# EAGLE design GFB_Sensorknoten (EAGLE 9.6.2)

## Sheet 1 of 6: Spannungsversorgung
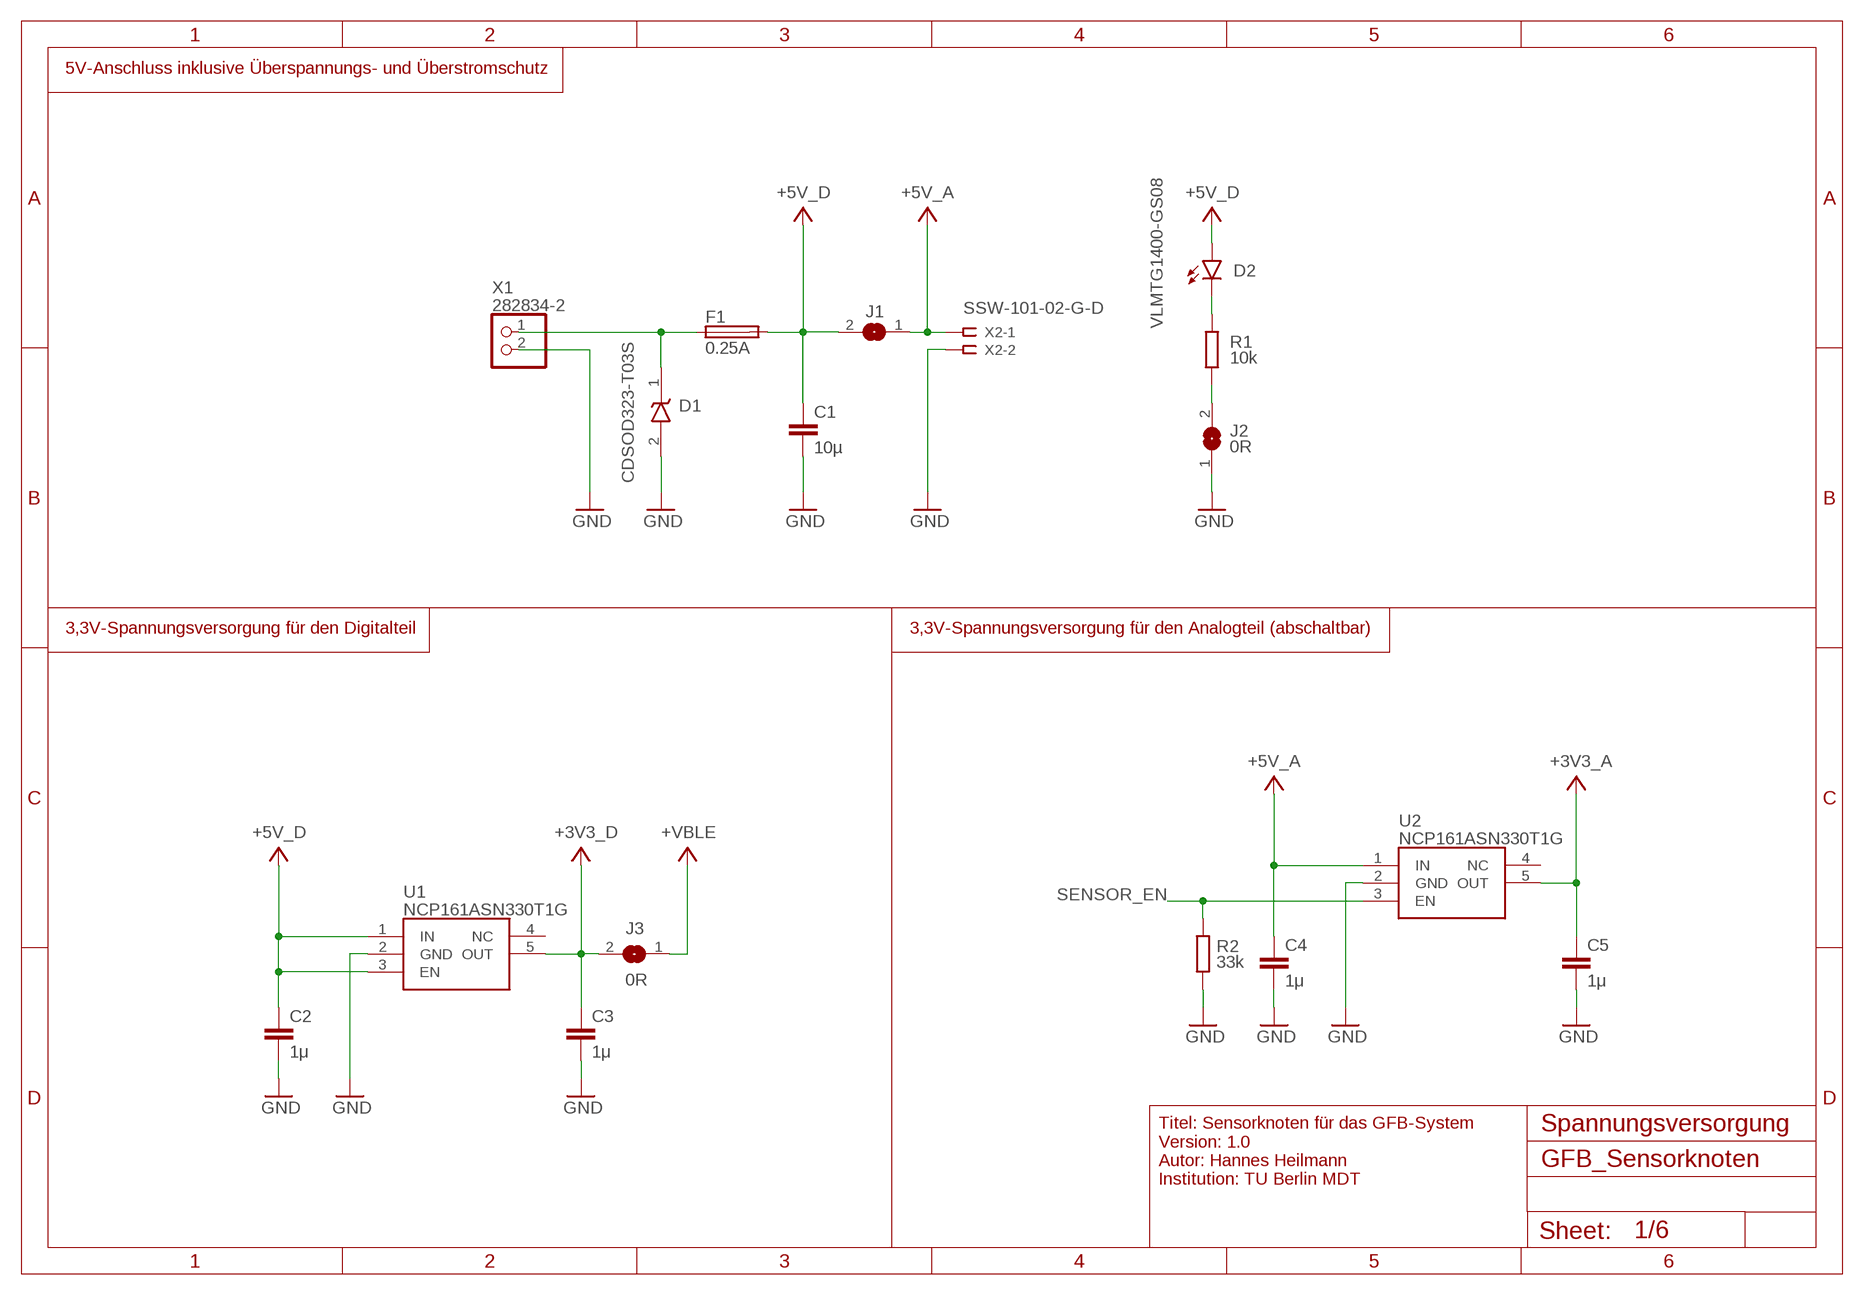
[diagram p0: schematic, sheet 1]

### Parts
C1  10µ  C_OUTLINEC0603_OUTLINE  [PATCHPOLYGRAPHV1_1608M]
C2  1μ  C_OUTLINEC0603_OUTLINE  [PATCHPOLYGRAPHV1_1608M]
C3  1μ  C_OUTLINEC0603_OUTLINE  [PATCHPOLYGRAPHV1_1608M]
C4  1μ  C_OUTLINEC0603_OUTLINE  [PATCHPOLYGRAPHV1_1608M]
C5  1μ  C_OUTLINEC0603_OUTLINE  [PATCHPOLYGRAPHV1_1608M]
D1  CDSOD323-T03S  [SOD2513X114N]
D2  VLMTG1400-GS08  LEDCHIP-LED0603  [CHIP-LED0603]
F1  SF-0603FP025F-2  [R0603]
J1  SJ  [SJ]
J2  0R  JUMPER_0402  [PATCHPOLYGRAPHV1_1005M]
J3  0R  JUMPER_0402  [PATCHPOLYGRAPHV1_1005M]
R1  10k  R_OUTLINER0402_OUTLINE  [PATCHPOLYGRAPHV1_1005M]
R2  33k  R_OUTLINER0402_OUTLINE  [PATCHPOLYGRAPHV1_1005M]
U1  NCP161ASN330T1G  [SOT95P280X145-5N]
U2  NCP161ASN330T1G  [SOT95P280X145-5N]
X1  282834-2  [SHDR2W85P0X254_1X2_554X650X103]
X2  SSW-101-02-G-D  [SSW-101-02-G-D]

### Nets
+3V3_A: C5.1 U2.5(OUT) ; also sheet 3,4
+3V3_D: C3.1 J3.2 U1.5(OUT) ; also sheet 3,5,6
+5V_A: C4.1 J1.1 U2.1(IN) X2.1
+5V_D: C1.1 C2.1 D2.A F1.2 J1.2 U1.1(IN) U1.3(EN)
+VBLE: J3.1 ; also sheet 2
GND: C1.2 C2.2 C3.2 C4.2 C5.2 D1.2(A) J2.1 R2.1 U1.2(GND) U2.2(GND) X1.2 X2.2 ; also sheet 2,3,4,5,6
N$1: J2.2 R1.1
N$24: D2.C R1.2
N$26: D1.1(K) F1.1 X1.1
SENSOR_EN: R2.2 U2.3(EN) ; also sheet 3
Unconnected: U1.4(NC) U2.4(NC)

### Notes on the sheet
- 5V-Anschluss inklusive Überspannungs- und Überstromschutz
- 0.25A
- 3,3V-Spannungsversorgung für den Digitalteil | 3,3V-Spannungsversorgung für den Analogteil (abschaltbar)
- Spannungsversorgung
- Titel: Sensorknoten für das GFB-System
  Version: 1.0
  Autor: Hannes Heilmann
  Institution: TU Berlin MDT

## Sheet 2 of 6: Data-Transmission-MCU
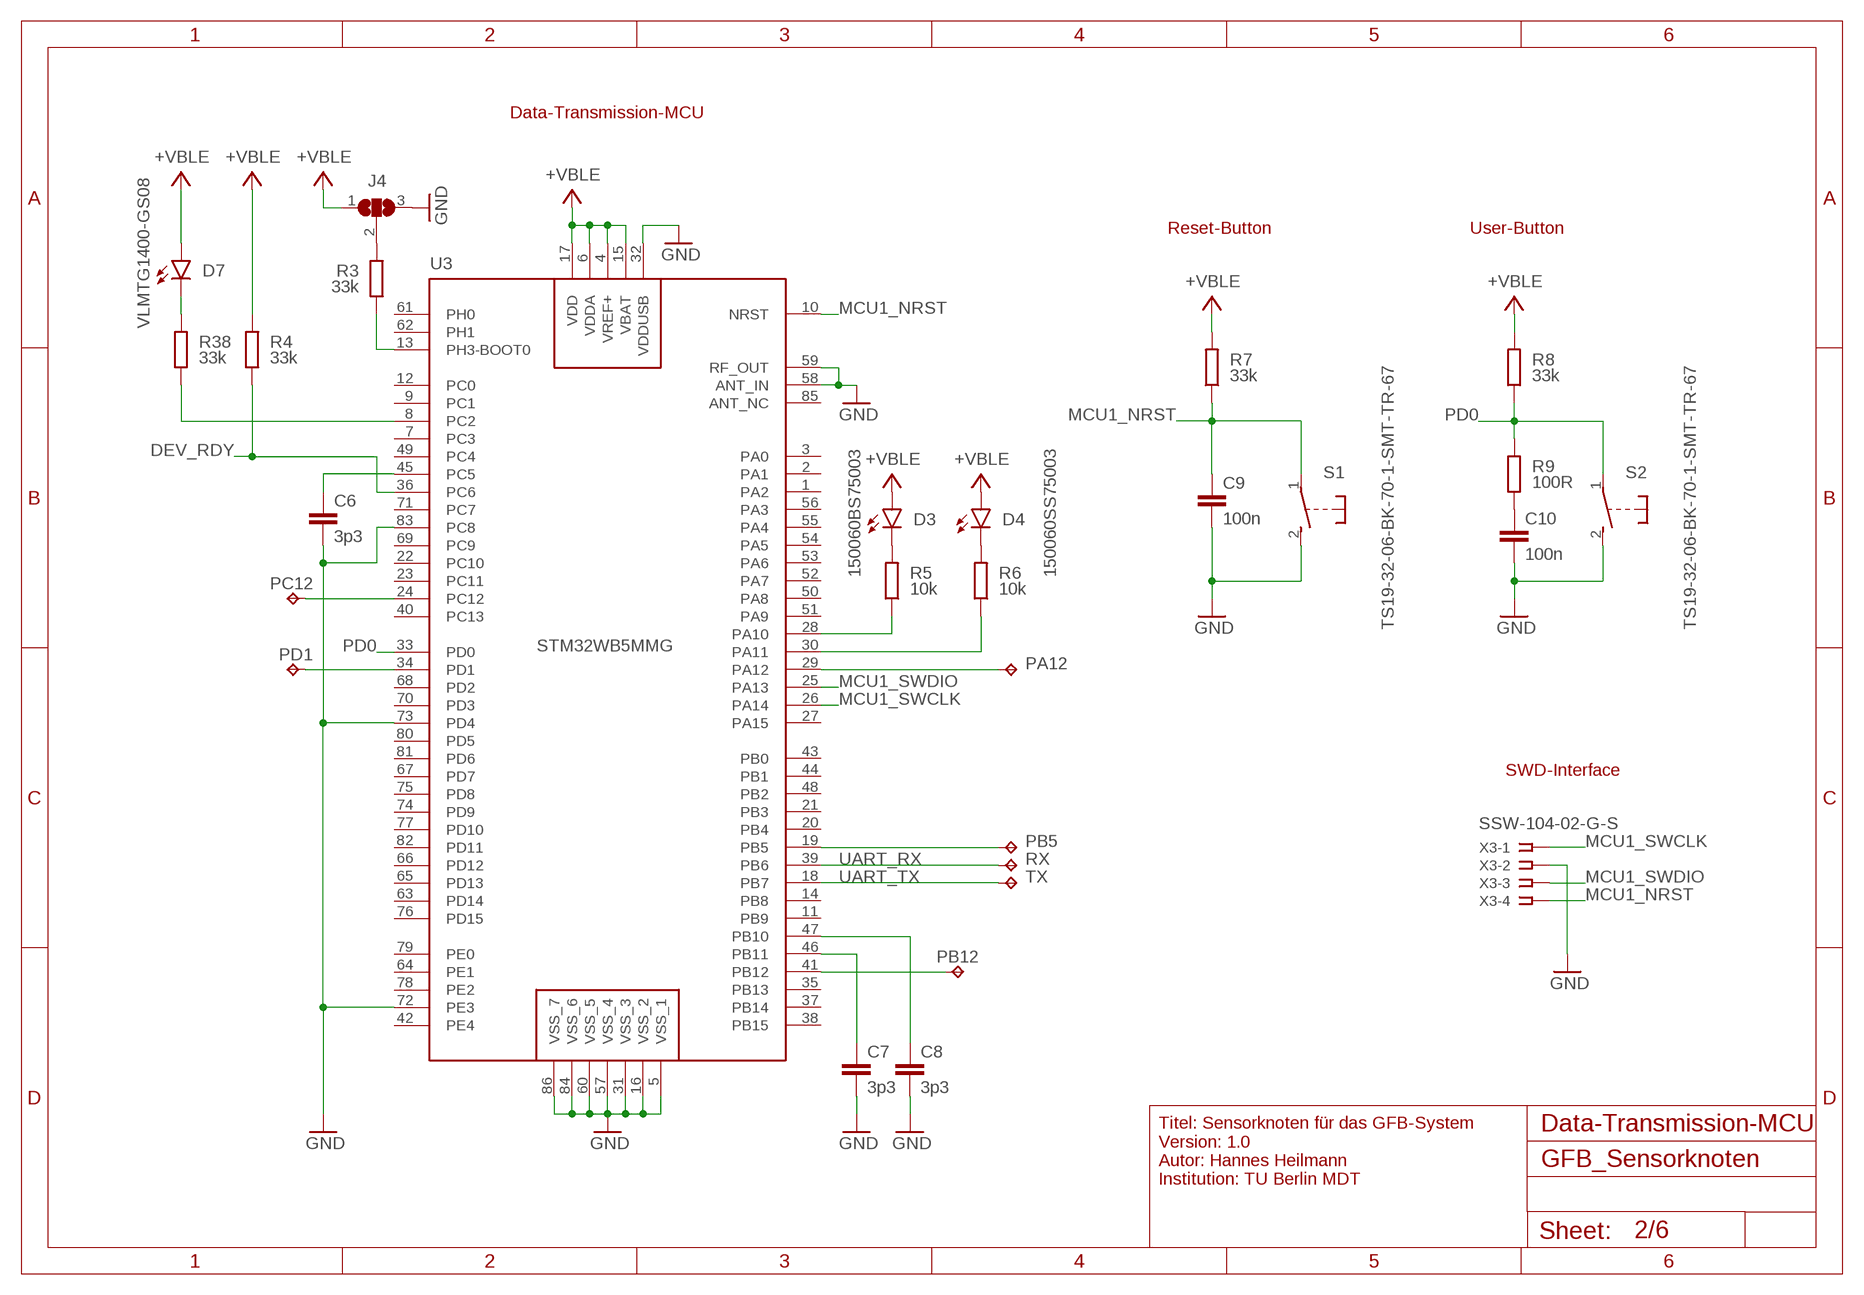
[diagram p1: schematic, sheet 2]

### Parts
C6  3p3  C_OUTLINEC0402_OUTLINE  [PATCHPOLYGRAPHV1_1005M]
C7  3p3  C_OUTLINEC0402_OUTLINE  [PATCHPOLYGRAPHV1_1005M]
C8  3p3  C_OUTLINEC0402_OUTLINE  [PATCHPOLYGRAPHV1_1005M]
C9  100n  C_OUTLINEC0402_OUTLINE  [PATCHPOLYGRAPHV1_1005M]
C10  100n  C_OUTLINEC0402_OUTLINE  [PATCHPOLYGRAPHV1_1005M]
D3  150060BS75003  LEDCHIP-LED0603  [CHIP-LED0603]
D4  150060SS75003  LEDCHIP-LED0603  [CHIP-LED0603]
D7  VLMTG1400-GS08  LEDCHIP-LED0603  [CHIP-LED0603]
J4  JUMPER_3JUMPER_3_0402  [JUMPER_3_0402]
PA12  TPTP06R  [TP06R]
PB5  TPTP06R  [TP06R]
PB12  TPTP06R  [TP06R]
PC12  TPTP06R  [TP06R]
PD1  TPTP06R  [TP06R]
R3  33k  R_OUTLINER0402_OUTLINE  [PATCHPOLYGRAPHV1_1005M]
R4  33k  R_OUTLINER0402_OUTLINE  [PATCHPOLYGRAPHV1_1005M]
R5  10k  R_OUTLINER0402_OUTLINE  [PATCHPOLYGRAPHV1_1005M]
R6  10k  R_OUTLINER0402_OUTLINE  [PATCHPOLYGRAPHV1_1005M]
R7  33k  R_OUTLINER0402_OUTLINE  [PATCHPOLYGRAPHV1_1005M]
R8  33k  R_OUTLINER0402_OUTLINE  [PATCHPOLYGRAPHV1_1005M]
R9  100R  R_OUTLINER0402_OUTLINE  [PATCHPOLYGRAPHV1_1005M]
R38  33k  R_OUTLINER0402_OUTLINE  [PATCHPOLYGRAPHV1_1005M]
RX  TPTP06R  [TP06R]
S1  TS19-32-06-BK-70-1-SMT-TR-67  [TS193206BK701SMTTR67]
S2  TS19-32-06-BK-70-1-SMT-TR-67  [TS193206BK701SMTTR67]
TX  TPTP06R  [TP06R]
U3  STM32WB5MMG  [STM32WB5MMG]
X3  SSW-104-02-G-S  [SSW-104-02-G-S]

### Nets
+VBLE: D3.A D4.A D7.A J4.1 R4.2 R7.2 R8.2 U3.4(VREF+) U3.6(VDDA) U3.15(VBAT) U3.17(VDD) ; also sheet 1
DEV_RDY: R4.1 U3.36(PC6) ; also sheet 3
GND: C6.2 C7.2 C8.2 C9.2 C10.2 J4.3 S1.2(S) S2.2(S) U3.5(VSS_1) U3.16(VSS_2) U3.31(VSS_3) U3.32(VDDUSB) U3.57(VSS_4) U3.58(ANT_IN) U3.59(RF_OUT) U3.60(VSS_5) U3.72(PE3) U3.73(PD4) U3.83(PC8) U3.84(VSS_6) U3.86(VSS_7) X3.2 ; also sheet 1,3,4,5,6
MCU1_NRST: C9.1 R7.1 S1.1(P) U3.10(NRST) X3.4
MCU1_SWCLK: U3.26(PA14) X3.1
MCU1_SWDIO: U3.25(PA13) X3.3
N$6: R3.1 U3.13(PH3-BOOT0)
N$10: C6.1 U3.45(PC5)
N$11: D3.C R5.2
N$17: D4.C R6.2
N$19: C10.1 R9.1
N$20: PB12.TP U3.41(PB12)
N$21: PD1.TP U3.34(PD1)
N$22: PC12.TP U3.24(PC12)
N$27: R38.1 U3.8(PC2)
N$30: D7.C R38.2
N$38: J4.2 R3.2
PA10: R5.1 U3.28(PA10)
PA11: R6.1 U3.30(PA11)
PB10: C8.1 U3.47(PB10)
PB11: C7.1 U3.46(PB11)
PD0: R8.1 R9.2 S2.1(P) U3.33(PD0)
UART_RES_RX: PA12.TP U3.29(PA12)
UART_RES_TX: PB5.TP U3.19(PB5)
UART_RX: RX.TP U3.39(PB6) ; also sheet 3
UART_TX: TX.TP U3.18(PB7) ; also sheet 3
Unconnected: U3.1(PA2) U3.2(PA1) U3.3(PA0) U3.7(PC3) U3.9(PC1) U3.11(PB9) U3.12(PC0) U3.14(PB8) U3.20(PB4) U3.21(PB3) U3.22(PC10) U3.23(PC11) U3.27(PA15) U3.35(PB13) U3.37(PB14) U3.38(PB15) U3.40(PC13) U3.42(PE4) U3.43(PB0) U3.44(PB1) U3.48(PB2) U3.49(PC4) U3.50(PA8) U3.51(PA9) U3.52(PA7) U3.53(PA6) U3.54(PA5) U3.55(PA4) U3.56(PA3) U3.61(PH0) U3.62(PH1) U3.63(PD14) U3.64(PE1) U3.65(PD13) U3.66(PD12) U3.67(PD7) U3.68(PD2) U3.69(PC9) U3.70(PD3) U3.71(PC7) U3.74(PD9) U3.75(PD8) U3.76(PD15) U3.77(PD10) U3.78(PE2) U3.79(PE0) U3.80(PD5) U3.81(PD6) U3.82(PD11) U3.85(ANT_NC)

### Notes on the sheet
- Data-Transmission-MCU
- Reset-Button | User-Button
- SWD-Interface
- Data-Transmission-MCU
- Titel: Sensorknoten für das GFB-System
  Version: 1.0
  Autor: Hannes Heilmann
  Institution: TU Berlin MDT

## Sheet 3 of 6: Data-Aquisition-MCU
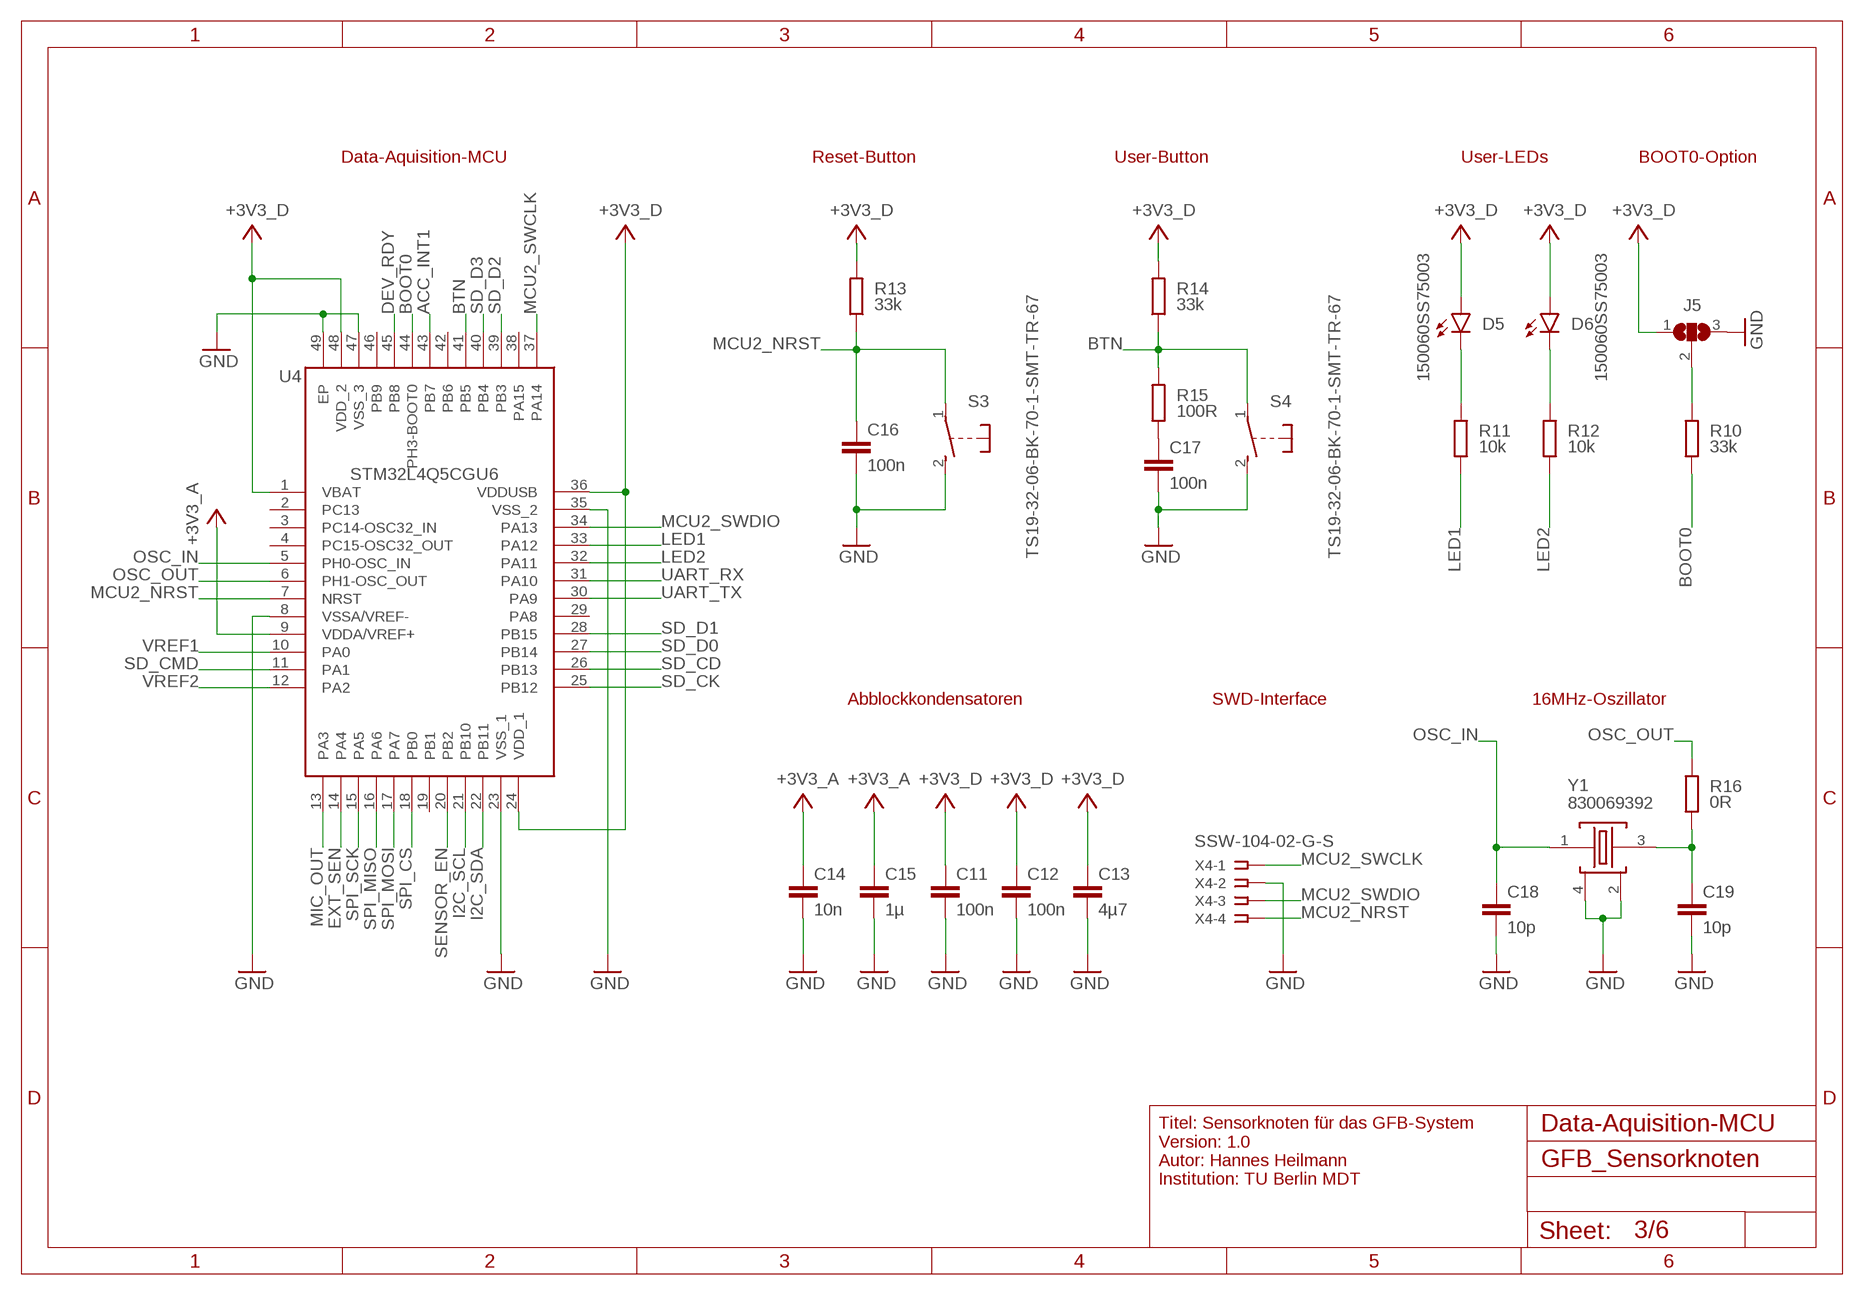
[diagram p2: schematic, sheet 3]

### Parts
C11  100n  C_OUTLINEC0402_OUTLINE  [PATCHPOLYGRAPHV1_1005M]
C12  100n  C_OUTLINEC0402_OUTLINE  [PATCHPOLYGRAPHV1_1005M]
C13  4µ7  C_OUTLINEC0603_OUTLINE  [PATCHPOLYGRAPHV1_1608M]
C14  10n  C_OUTLINEC0402_OUTLINE  [PATCHPOLYGRAPHV1_1005M]
C15  1µ  C_OUTLINEC0603_OUTLINE  [PATCHPOLYGRAPHV1_1608M]
C16  100n  C_OUTLINEC0402_OUTLINE  [PATCHPOLYGRAPHV1_1005M]
C17  100n  C_OUTLINEC0402_OUTLINE  [PATCHPOLYGRAPHV1_1005M]
C18  10p  C_OUTLINEC0402_OUTLINE  [PATCHPOLYGRAPHV1_1005M]
C19  10p  C_OUTLINEC0402_OUTLINE  [PATCHPOLYGRAPHV1_1005M]
D5  150060SS75003  LEDCHIP-LED0603  [CHIP-LED0603]
D6  150060SS75003  LEDCHIP-LED0603  [CHIP-LED0603]
J5  JUMPER_3JUMPER_3_0402  [JUMPER_3_0402]
R10  33k  R_OUTLINER0402_OUTLINE  [PATCHPOLYGRAPHV1_1005M]
R11  10k  R_OUTLINER0402_OUTLINE  [PATCHPOLYGRAPHV1_1005M]
R12  10k  R_OUTLINER0402_OUTLINE  [PATCHPOLYGRAPHV1_1005M]
R13  33k  R_OUTLINER0402_OUTLINE  [PATCHPOLYGRAPHV1_1005M]
R14  33k  R_OUTLINER0402_OUTLINE  [PATCHPOLYGRAPHV1_1005M]
R15  100R  R_OUTLINER0402_OUTLINE  [PATCHPOLYGRAPHV1_1005M]
R16  0R  R_OUTLINER0402_OUTLINE  [PATCHPOLYGRAPHV1_1005M]
S3  TS19-32-06-BK-70-1-SMT-TR-67  [TS193206BK701SMTTR67]
S4  TS19-32-06-BK-70-1-SMT-TR-67  [TS193206BK701SMTTR67]
U4  STM32L4Q5CGU6  [QFN50P700X700X65-49N]
X4  SSW-104-02-G-S  [SSW-104-02-G-S]
Y1  830069392  [830069392]

### Nets
+3V3_A: C14.1 C15.1 U4.9(VDDA/VREF+) ; also sheet 1,4
+3V3_D: C11.1 C12.1 C13.1 D5.A D6.A J5.1 R13.2 R14.2 U4.1(VBAT) U4.24(VDD_1) U4.36(VDDUSB) U4.48(VDD_2) ; also sheet 1,5,6
ACC_INT1: U4.43(PB7) ; also sheet 5
BOOT0: R10.1 U4.44(PH3-BOOT0)
BTN: R14.1 R15.2 S4.1(P) U4.41(PB5)
DEV_RDY: U4.45(PB8) ; also sheet 2
EXT_SEN: U4.14(PA4) ; also sheet 4
GND: C11.2 C12.2 C13.2 C14.2 C15.2 C16.2 C17.2 C18.2 C19.2 J5.3 S3.2(S) S4.2(S) U4.8(VSSA/VREF-) U4.23(VSS_1) U4.35(VSS_2) U4.47(VSS_3) U4.49(EP) X4.2 Y1.2(GND_1) Y1.4(GND_2) ; also sheet 1,2,4,5,6
I2C_SCL: U4.21(PB10) ; also sheet 5
I2C_SDA: U4.22(PB11) ; also sheet 5
LED1: R11.1 U4.33(PA12)
LED2: R12.1 U4.32(PA11)
MCU2_NRST: C16.1 R13.1 S3.1(P) U4.7(NRST) X4.4
MCU2_SWCLK: U4.37(PA14) X4.1
MCU2_SWDIO: U4.34(PA13) X4.3
MIC_OUT: U4.13(PA3) ; also sheet 4
N$2: C17.1 R15.1
N$23: C19.1 R16.1 Y1.3(OSC_2)
N$28: D5.C R11.2
N$29: D6.C R12.2
N$39: J5.2 R10.2
OSC_IN: C18.1 U4.5(PH0-OSC_IN) Y1.1(OSC_1)
OSC_OUT: R16.2 U4.6(PH1-OSC_OUT)
SD_CD: U4.26(PB13) ; also sheet 6
SD_CK: U4.25(PB12) ; also sheet 6
SD_CMD: U4.11(PA1) ; also sheet 6
SD_D0: U4.27(PB14) ; also sheet 6
SD_D1: U4.28(PB15) ; also sheet 6
SD_D2: U4.39(PB3) ; also sheet 6
SD_D3: U4.40(PB4) ; also sheet 6
SENSOR_EN: U4.20(PB2) ; also sheet 1
SPI_CS: U4.18(PB0) ; also sheet 5
SPI_MISO: U4.16(PA6) ; also sheet 5
SPI_MOSI: U4.17(PA7) ; also sheet 5
SPI_SCK: U4.15(PA5) ; also sheet 5
UART_RX: U4.31(PA10) ; also sheet 2
UART_TX: U4.30(PA9) ; also sheet 2
VREF1: U4.10(PA0) ; also sheet 4
VREF2: U4.12(PA2) ; also sheet 4
Unconnected: U4.2(PC13) U4.3(PC14-OSC32_IN) U4.4(PC15-OSC32_OUT) U4.19(PB1) U4.29(PA8) U4.38(PA15) U4.42(PB6) U4.46(PB9)

### Notes on the sheet
- Data-Aquisition-MCU | Reset-Button | User-Button | User-LEDs | BOOT0-Option
- Abblockkondensatoren | SWD-Interface | 16MHz-Oszillator
- Data-Aquisition-MCU
- Titel: Sensorknoten für das GFB-System
  Version: 1.0
  Autor: Hannes Heilmann
  Institution: TU Berlin MDT

## Sheet 4 of 6: Analoge Sensorik
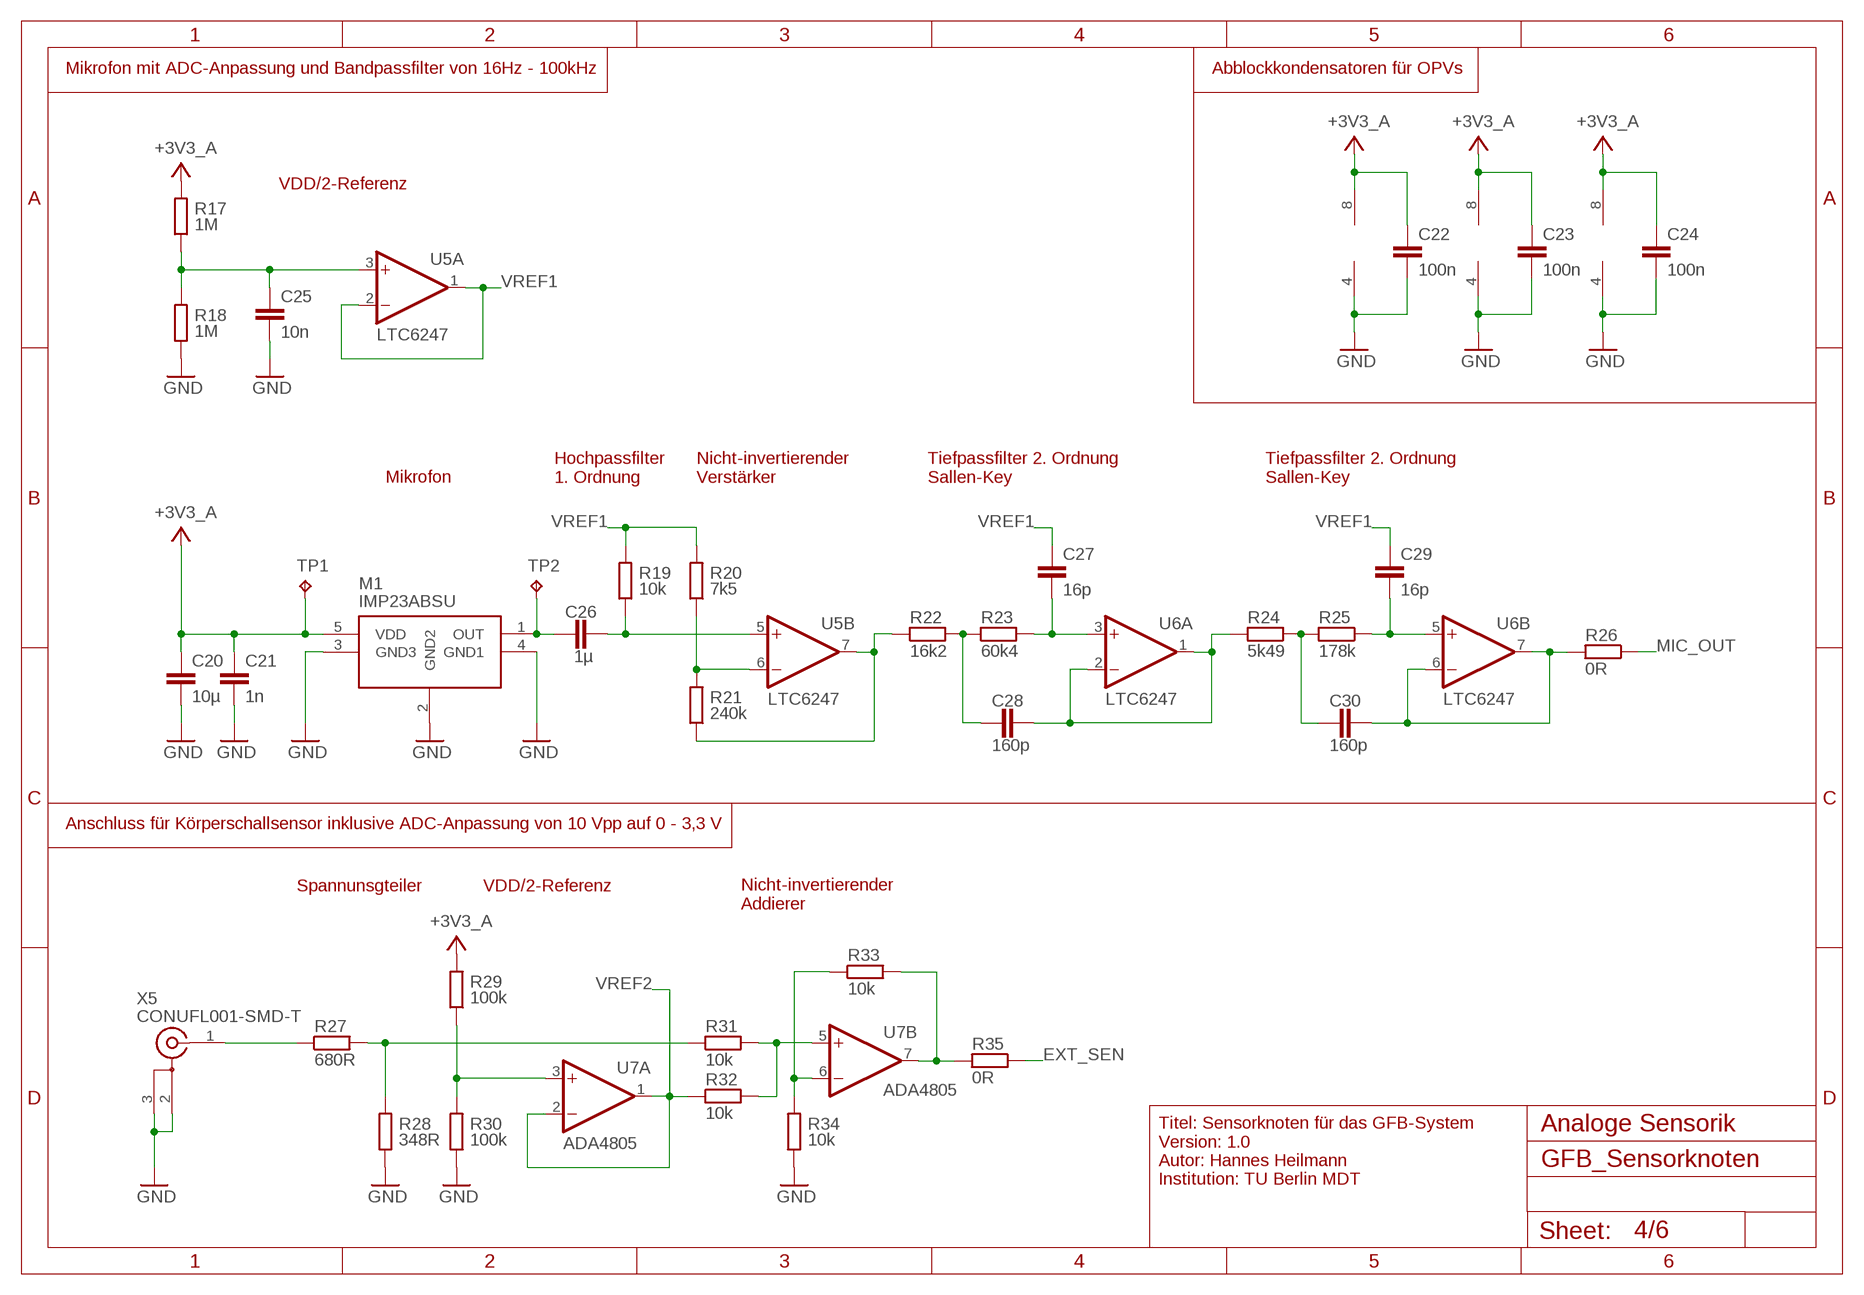
[diagram p3: schematic, sheet 4]

### Parts
C20  10µ  C_OUTLINEC0603_OUTLINE  [PATCHPOLYGRAPHV1_1608M]
C21  1n  C_OUTLINEC0402_OUTLINE  [PATCHPOLYGRAPHV1_1005M]
C22  100n  C_OUTLINEC0402_OUTLINE  [PATCHPOLYGRAPHV1_1005M]
C23  100n  C_OUTLINEC0402_OUTLINE  [PATCHPOLYGRAPHV1_1005M]
C24  100n  C_OUTLINEC0402_OUTLINE  [PATCHPOLYGRAPHV1_1005M]
C25  10n  C_OUTLINEC0402_OUTLINE  [PATCHPOLYGRAPHV1_1005M]
C26  1µ  C_OUTLINEC0603_OUTLINE  [PATCHPOLYGRAPHV1_1608M]
C27  16p  C_OUTLINEC0402_OUTLINE  [PATCHPOLYGRAPHV1_1005M]
C28  160p  C_OUTLINEC0402_OUTLINE  [PATCHPOLYGRAPHV1_1005M]
C29  16p  C_OUTLINEC0402_OUTLINE  [PATCHPOLYGRAPHV1_1005M]
C30  160p  C_OUTLINEC0402_OUTLINE  [PATCHPOLYGRAPHV1_1005M]
M1  IMP23ABSU  [IMP23ABSU]
R17  1M  R_OUTLINER0402_OUTLINE  [PATCHPOLYGRAPHV1_1005M]
R18  1M  R_OUTLINER0402_OUTLINE  [PATCHPOLYGRAPHV1_1005M]
R19  10k  R_OUTLINER0402_OUTLINE  [PATCHPOLYGRAPHV1_1005M]
R20  7k5  R_OUTLINER0402_OUTLINE  [PATCHPOLYGRAPHV1_1005M]
R21  240k  R_OUTLINER0402_OUTLINE  [PATCHPOLYGRAPHV1_1005M]
R22  16k2  R_OUTLINER0402_OUTLINE  [PATCHPOLYGRAPHV1_1005M]
R23  60k4  R_OUTLINER0402_OUTLINE  [PATCHPOLYGRAPHV1_1005M]
R24  5k49  R_OUTLINER0402_OUTLINE  [PATCHPOLYGRAPHV1_1005M]
R25  178k  R_OUTLINER0402_OUTLINE  [PATCHPOLYGRAPHV1_1005M]
R26  0R  R_OUTLINER0402_OUTLINE  [PATCHPOLYGRAPHV1_1005M]
R27  680R  R_OUTLINER0402_OUTLINE  [PATCHPOLYGRAPHV1_1005M]
R28  348R  R_OUTLINER0402_OUTLINE  [PATCHPOLYGRAPHV1_1005M]
R29  100k  R_OUTLINER0402_OUTLINE  [PATCHPOLYGRAPHV1_1005M]
R30  100k  R_OUTLINER0402_OUTLINE  [PATCHPOLYGRAPHV1_1005M]
R31  10k  R_OUTLINER0402_OUTLINE  [PATCHPOLYGRAPHV1_1005M]
R32  10k  R_OUTLINER0402_OUTLINE  [PATCHPOLYGRAPHV1_1005M]
R33  10k  R_OUTLINER0402_OUTLINE  [PATCHPOLYGRAPHV1_1005M]
R34  10k  R_OUTLINER0402_OUTLINE  [PATCHPOLYGRAPHV1_1005M]
R35  0R  R_OUTLINER0402_OUTLINE  [PATCHPOLYGRAPHV1_1005M]
TP1  TPTP06R  [TP06R]
TP2  TPTP06R  [TP06R]
U5  LTC6247  LTC6247CMS8#PBF  [SOP65P490X110-8N]
U6  LTC6247  LTC6247CMS8#PBF  [SOP65P490X110-8N]
U7  ADA4805  ADA4805-2ARMZ-R7  [SOP65P490X110-8N]
X5  CONUFL001-SMD-T  [CONUFL001-SMD]

### Nets
+3V3_A: C20.1 C21.1 C22.1 C23.1 C24.1 M1.5(VDD) R17.2 R29.2 TP1.TP U5.8(P:V+) U6.8(P:V+) U7.8(P:V+) ; also sheet 1,3
EXT_SEN: R35.1 ; also sheet 3
GND: C20.2 C21.2 C22.2 C23.2 C24.2 C25.2 M1.2(GND2) M1.3(GND3) M1.4(GND1) R18.1 R28.1 R30.1 R34.1 U5.4(P:V-) U6.4(P:V-) U7.4(P:V-) X5.2(GND_1) X5.3(GND_2) ; also sheet 1,2,3,5,6
MIC_OUT: R26.1 ; also sheet 3
MIC_Q0: C26.2 R19.1 U5.5(B:+IN)
MIC_Q1: R21.1 R22.1 U5.7(B:OUT)
MIC_Q2: C28.1 R24.2 U6.1(A:OUT) U6.2(A:-IN)
N$3: C26.1 M1.1(OUT) TP2.TP
N$4: C25.1 R17.1 R18.2 U5.3(A:+IN)
N$5: R20.1 R21.2 U5.6(B:-IN)
N$7: C28.2 R22.2 R23.1
N$8: C29.2 R25.1 U6.5(B:+IN)
N$9: C27.2 R23.2 U6.3(A:+IN)
N$12: R27.1 X5.1(SIG)
N$13: C30.2 R24.1 R25.2
N$14: R27.2 R28.2 R31.1
N$15: R29.1 R30.2 U7.3(A:+IN)
N$16: R33.1 R34.2 U7.6(B:-IN)
N$18: R31.2 R32.2 U7.5(B:+IN)
N$36: C30.1 R26.2 U6.6(B:-IN) U6.7(B:OUT)
N$37: R33.2 R35.2 U7.7(B:OUT)
VREF1: C27.1 C29.1 R19.2 R20.2 U5.1(A:OUT) U5.2(A:-IN) ; also sheet 3
VREF2: R32.1 U7.1(A:OUT) U7.2(A:-IN) ; also sheet 3

### Notes on the sheet
- Mikrofon mit ADC-Anpassung und Bandpassfilter von 16Hz - 100kHz | Abblockkondensatoren für OPVs
- VDD/2-Referenz
- Mikrofon
- Hochpassfilter
  1. Ordnung
- Nicht-invertierender
  Verstärker
- Tiefpassfilter 2. Ordnung
  Sallen-Key
- Tiefpassfilter 2. Ordnung
  Sallen-Key
- Anschluss für Körperschallsensor inklusive ADC-Anpassung von 10 Vpp auf 0 - 3,3 V
- Spannunsgteiler | VDD/2-Referenz
- Nicht-invertierender
  Addierer
- Analoge Sensorik
- Titel: Sensorknoten für das GFB-System
  Version: 1.0
  Autor: Hannes Heilmann
  Institution: TU Berlin MDT

## Sheet 5 of 6: Digitale Sensoren
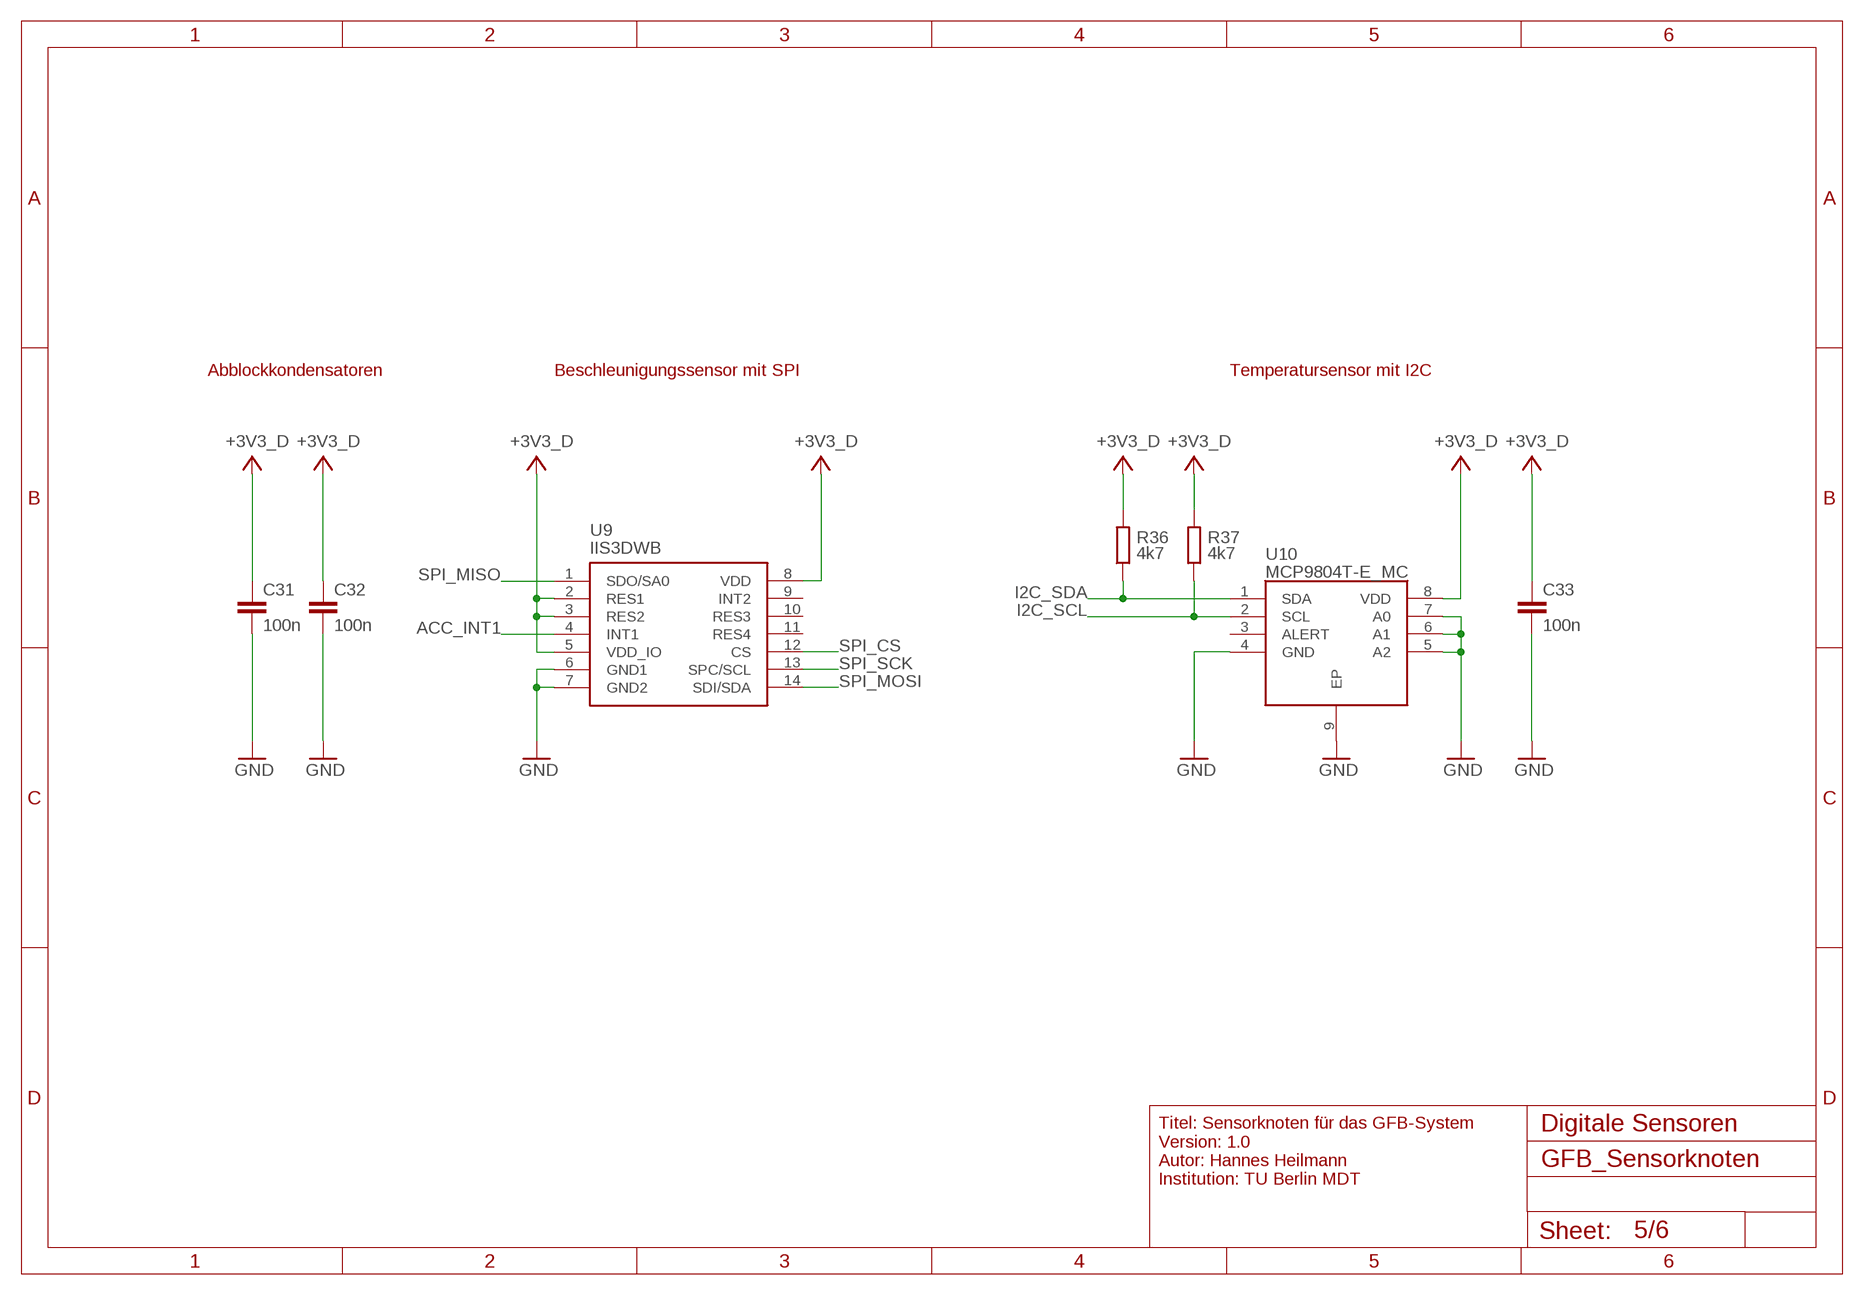
[diagram p4: schematic, sheet 5]

### Parts
C31  100n  C_OUTLINEC0402_OUTLINE  [PATCHPOLYGRAPHV1_1005M]
C32  100n  C_OUTLINEC0402_OUTLINE  [PATCHPOLYGRAPHV1_1005M]
C33  100n  C_OUTLINEC0402_OUTLINE  [PATCHPOLYGRAPHV1_1005M]
R36  4k7  R_OUTLINER0402_OUTLINE  [PATCHPOLYGRAPHV1_1005M]
R37  4k7  R_OUTLINER0402_OUTLINE  [PATCHPOLYGRAPHV1_1005M]
U9  IIS3DWB  [IIS3DWB]
U10  MCP9804T-E_MC  [SON50P300X200X100-9N]

### Nets
+3V3_D: C31.1 C32.1 C33.1 R36.2 R37.2 U9.2(RES1) U9.3(RES2) U9.5(VDD_IO) U9.8(VDD) U10.8(VDD) ; also sheet 1,3,6
ACC_INT1: U9.4(INT1) ; also sheet 3
GND: C31.2 C32.2 C33.2 U9.6(GND1) U9.7(GND2) U10.4(GND) U10.5(A2) U10.6(A1) U10.7(A0) U10.9(EP) ; also sheet 1,2,3,4,6
I2C_SCL: R37.1 U10.2(SCL) ; also sheet 3
I2C_SDA: R36.1 U10.1(SDA) ; also sheet 3
SPI_CS: U9.12(CS) ; also sheet 3
SPI_MISO: U9.1(SDO/SA0) ; also sheet 3
SPI_MOSI: U9.14(SDI/SDA) ; also sheet 3
SPI_SCK: U9.13(SPC/SCL) ; also sheet 3
Unconnected: U9.9(INT2) U9.10(RES3) U9.11(RES4) U10.3(ALERT)

### Notes on the sheet
- Abblockkondensatoren | Beschleunigungssensor mit SPI | Temperatursensor mit I2C
- Digitale Sensoren
- Titel: Sensorknoten für das GFB-System
  Version: 1.0
  Autor: Hannes Heilmann
  Institution: TU Berlin MDT

## Sheet 6 of 6: microSD-Karte
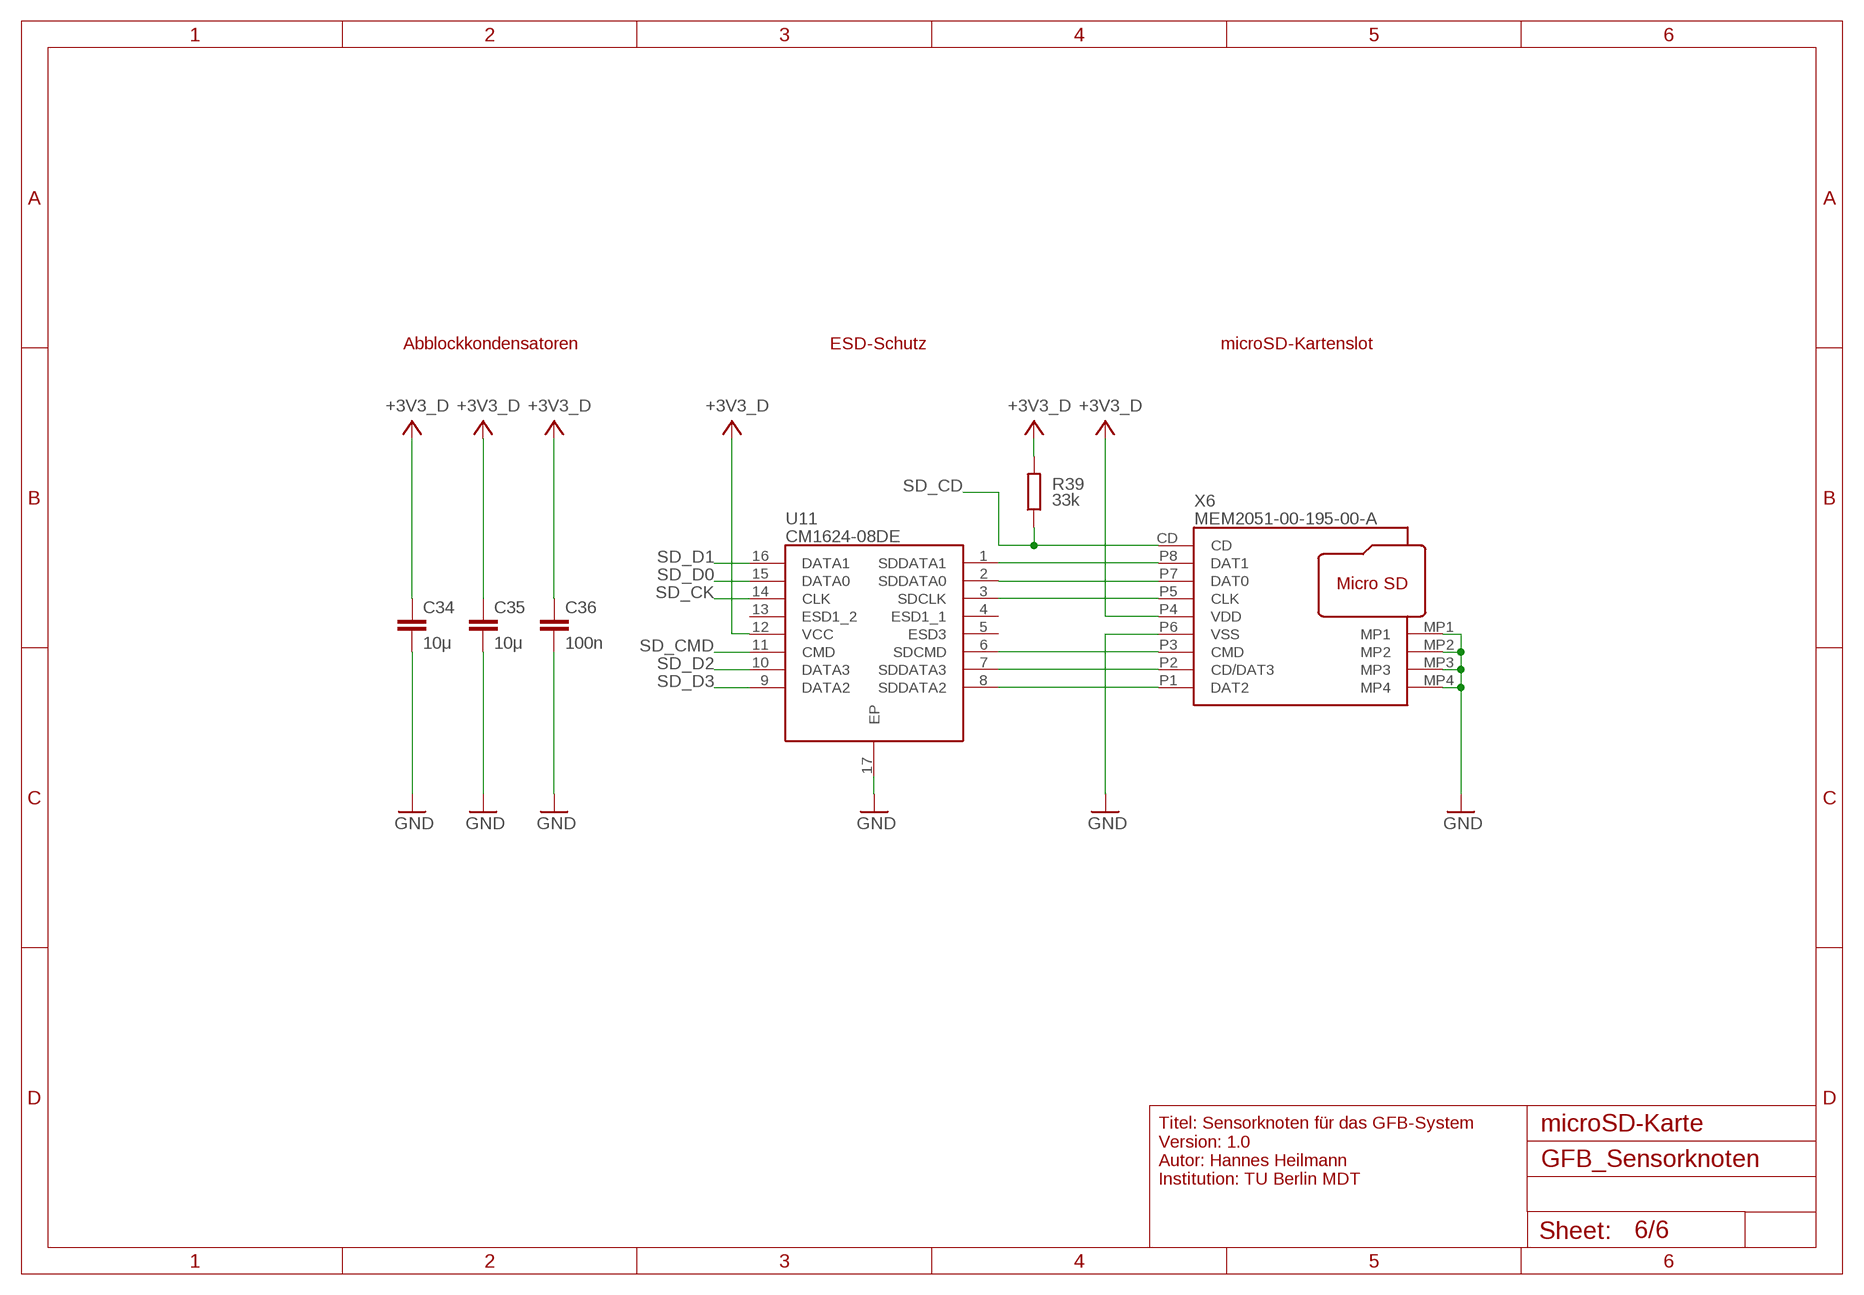
[diagram p5: schematic, sheet 6]

### Parts
C34  10μ  C_OUTLINEC0603_OUTLINE  [PATCHPOLYGRAPHV1_1608M]
C35  10μ  C_OUTLINEC0603_OUTLINE  [PATCHPOLYGRAPHV1_1608M]
C36  100n  C_OUTLINEC0402_OUTLINE  [PATCHPOLYGRAPHV1_1005M]
R39  33k  R_OUTLINER0402_OUTLINE  [PATCHPOLYGRAPHV1_1005M]
U11  CM1624-08DE  [SON40P135X330X55-17N]
X6  MEM2051-00-195-00-A  [MEM20510019500A]

### Nets
+3V3_D: C34.1 C35.1 C36.1 R39.2 U11.12(VCC) X6.P4(VDD) ; also sheet 1,3,5
GND: C34.2 C35.2 C36.2 U11.17(EP) X6.MP1 X6.MP2 X6.MP3 X6.MP4 X6.P6(VSS) ; also sheet 1,2,3,4,5
N$25: U11.1(SDDATA1) X6.P8(DAT1)
N$31: U11.3(SDCLK) X6.P5(CLK)
N$32: U11.7(SDDATA3) X6.P2(CD/DAT3)
N$33: U11.8(SDDATA2) X6.P1(DAT2)
N$34: U11.2(SDDATA0) X6.P7(DAT0)
N$35: U11.6(SDCMD) X6.P3(CMD)
SD_CD: R39.1 X6.CD ; also sheet 3
SD_CK: U11.14(CLK) ; also sheet 3
SD_CMD: U11.11(CMD) ; also sheet 3
SD_D0: U11.15(DATA0) ; also sheet 3
SD_D1: U11.16(DATA1) ; also sheet 3
SD_D2: U11.10(DATA3) ; also sheet 3
SD_D3: U11.9(DATA2) ; also sheet 3
Unconnected: U11.4(ESD1_1) U11.5(ESD3) U11.13(ESD1_2)

### Notes on the sheet
- Abblockkondensatoren | ESD-Schutz | microSD-Kartenslot
- microSD-Karte
- Titel: Sensorknoten für das GFB-System
  Version: 1.0
  Autor: Hannes Heilmann
  Institution: TU Berlin MDT

## Library data of the parts
C1-C36 = RCL_outlines:C_OUTLINE: CAPACITOR, European symbol
D1 = SamacSys_Parts:CDSOD323-T03S: ESD Suppressors / TVS Diodes Unidirectional Std Cap Source: Datasheet <https://datasheet.datasheetarchive.com/originals/dk/DKDS-12/224732.pdf>; ARROW_PART_NUMBER: CDSOD323-T03S; ARROW_PRICE-STOCK: https://www.arrow.com/en/products/cdsod323-t03s/bourns?region=nac; DESCRIPTION: ESD Suppressors / TVS Diodes Unidirectional Std Cap; HEIGHT: 1.14mm; MANUFACTURER_NAME: Bourns; MANUFACTURER_PART_NUMBER: CDSOD323-T03S; MOUSER_PART_NUMBER: 652-CDSOD323-T03S; MOUSER_PRICE-STOCK: https://www.mouser.co.uk/ProductDetail/Bourns/CDSOD323-T03S?qs=6S5Watp5UnKvHMaJwkOReA%3D%3D
D2-D7 = led:LED: LED OSRAM: - CHIPLED LG R971, LG N971, LY N971, LG Q971, LY Q971, LO R971, LY R971 LH N974, LH R974 LS Q976, LO Q976, LY Q976 LO Q996 - Hyper CHIPLED LW Q18S LB Q993, LB Q99A, LB R99A - SideLED LS A670, LO A670, LY A670, LG A670, LP A670 LB A673, LV A673, LT A673, LW A673 LH A674 LY A675 LS A676, LA A676, LO A676, LY A676, LW A676 LS A679, LY A679, LG A679 - Hyper Micro SIDELED® LS Y876, LA Y876, LO Y876, LY Y876 LT Y87S - SmartLED LW L88C, LW L88S LB L89C, LB L89S, LG L890 LS L89K, LO L89K, LY L89K LS L896, LA L896, LO L896, LY L896 - TOPLED LS T670, LO T670, LY T670, LG T670, LP T670 LSG T670, LSP T670, LSY T670, LOP T670, LYG T670 LG T671, LOG T671, LSG T671 LB T673, LV T673, LT T673, LW T673 LH T674 LS T676, LA T676, LO T676, LY T676, LB T676, LH T676, LSB T676, LW T676 LB T67C, LV T67C, LT T67C, LS T67K, LO T67K, LY T67K, LW E67C LS E67B, LA E67B, LO E67B, LY E67B, LB E67C, LV E67C, LT E67C LW T67C LS T679, LY T679, LG T679 LS T770, LO T770, LY T770, LG T770, LP T770 LB T773, LV T773, LT T773, LW T773 LH T774 LS E675, LA E675, LY E675, LS T675 LS T776, LA T776, LO T776, LY T776, LB T776 LHGB T686 LT T68C, LB T68C - Hyper Mini TOPLED® LB M676 - Mini TOPLED Santana® LG M470 LS M47K, LO M47K, LY M47K Source: http://www.osram.convergy.de LUXEON: - LUMILED® LXK2-PW12-R00, LXK2-PW12-S00, LXK2-PW14-U00, LXK2-PW14-V00 LXK2-PM12-R00, LXK2-PM12-S00, LXK2-PM14-U00 LXK2-PE12-Q00, LXK2-PE12-R00, LXK2-PE12-S00, LXK2-PE14-T00, LXK2-PE14-U00 LXK2-PB12-K00, LXK2-PB12-L00, LXK2-PB12-M00, LXK2-PB14-N00, LXK2-PB14-P00, LXK2-PB14-Q00 LXK2-PR12-L00, LXK2-PR12-M00, LXK2-PR14-Q00, LXK2-PR14-R00 LXK2-PD12-Q00, LXK2-PD12-R00, LXK2-PD12-S00 LXK2-PH12-R00, LXK2-PH12-S00 LXK2-PL12-P00, LXK2-PL12-Q00, LXK2-PL12-R00 Source: www.luxeon.com KINGBRIGHT: KA-3528ASYC Source: www.kingbright.com
F1 = GFB_Sensorsystem:SF-0603FP025F-2
J1 = jumper:SJ: SMD solder JUMPER
J2 J3 = GFB_Sensorsystem:JUMPER_0402
J4 J5 = GFB_Sensorsystem:JUMPER_3
M1 = IMP23ABSU:IMP23ABSU
PA12 PB5 PB12 PC12 PD1 RX TP1 TP2 TX = testpad:TP: Test pad
R1-R39 = RCL_outlines:R_OUTLINE: RESISTOR, European symbol
S1-S4 = GFB_Sensorsystem:TS19-32-06-BK-70-1-SMT-TR-67: Tactile Switches 3 x 2 mm, 0.6 mm Actuator Height, 70 gf, Black, Surface Mount, TR, SPST, IP67, Tactile Switch Source: Datasheet <https://www.cuidevices.com/product/resource/ts19.pdf>; DESCRIPTION: Tactile Switches 3 x 2 mm, 0.6 mm Actuator Height, 70 gf, Black, Surface Mount, TR, SPST, IP67, Tactile Switch; HEIGHT: 0.65mm; MANUFACTURER_NAME: CUI Inc.; MANUFACTURER_PART_NUMBER: TS19-32-06-BK-70-1-SMT-TR-67; MOUSER_PART_NUMBER: 179-TS193206BK701SM; MOUSER_PRICE-STOCK: https://www.mouser.co.uk/ProductDetail/CUI-Devices/TS19-32-06-BK-70-1-SMT-TR-67?qs=tlsG%2FOw5FFj0aJkgA5InKg%3D%3D
U1 U2 = SamacSys_Parts:NCP161ASN330T1G: ON SEMICONDUCTOR - NCP161ASN330T1G - Fixed LDO Voltage Regulator, 1.9V to 5.5V, 225mV drop, 3.3V/450mA out, SOT-23-5 Source: Datasheet <https://componentsearchengine.com/Datasheets/2/NCP161ASN330T1G.pdf>; ARROW_PART_NUMBER: NCP161ASN330T1G; ARROW_PRICE-STOCK: https://www.arrow.com/en/products/ncp161asn330t1g/on-semiconductor?region=nac; DESCRIPTION: ON SEMICONDUCTOR - NCP161ASN330T1G - Fixed LDO Voltage Regulator, 1.9V to 5.5V, 225mV drop, 3.3V/450mA out, SOT-23-5; HEIGHT: 1.45mm; MANUFACTURER_NAME: onsemi; MANUFACTURER_PART_NUMBER: NCP161ASN330T1G; MOUSER_PART_NUMBER: 863-NCP161ASN330T1G; MOUSER_PRICE-STOCK: https://www.mouser.co.uk/ProductDetail/onsemi/NCP161ASN330T1G?qs=vLWxofP3U2ze5zA%252BHmAd3w%3D%3D
U3 = GFB_Sensorsystem:STM32WB5MMG
U4 = SamacSys_Parts:STM32L4Q5CGU6: Ultra-low-power with FPU Arm Cortex-M4 MCU 120 MHz with 1024 kbytes of Flash memory, USB OTG, DFSDM, CHROM-ART, AES, PKA Source: Datasheet <https://www.st.com/resource/en/datasheet/stm32l4q5ag.pdf>; ARROW_PART_NUMBER: STM32L4Q5CGU6; ARROW_PRICE-STOCK: https://www.arrow.com/en/products/stm32l4q5cgu6/stmicroelectronics?region=nac; DESCRIPTION: Ultra-low-power with FPU Arm Cortex-M4 MCU 120 MHz with 1024 kbytes of Flash memory, USB OTG, DFSDM, CHROM-ART, AES, PKA; HEIGHT: 0.65mm; MANUFACTURER_NAME: STMicroelectronics; MANUFACTURER_PART_NUMBER: STM32L4Q5CGU6; MOUSER_PART_NUMBER: 511-STM32L4Q5CGU6; MOUSER_PRICE-STOCK: https://www.mouser.co.uk/ProductDetail/STMicroelectronics/STM32L4Q5CGU6?qs=xZ%2FP%252Ba9zWqbcYF3PQ%2FnfoA%3D%3D
U5 U6 = GFB_Sensorsystem:LTC6247CMS8#PBF: OP AMP
U7 = GFB_Sensorsystem:ADA4805-2ARMZ-R7: OP AMP
U9 = GFB_Sensorsystem:IIS3DWB
U10 = SamacSys_Parts:MCP9804T-E_MC: Microchip MCP9804T-E/MC Temperature Sensor 8-Pin DFN, -40 +125 C Source: Datasheet <https://datasheet.datasheetarchive.com/originals/dk/DKDS41/DSANUWW0026507.pdf>; ARROW_PART_NUMBER: MCP9804T-E/MC; ARROW_PRICE-STOCK: https://www.arrow.com/en/products/mcp9804t-emc/microchip-technology?region=nac; DESCRIPTION: Microchip MCP9804T-E/MC Temperature Sensor 8-Pin DFN, -40 +125 C; HEIGHT: 1mm; MANUFACTURER_NAME: Microchip; MANUFACTURER_PART_NUMBER: MCP9804T-E/MC; MOUSER_PART_NUMBER: 579-MCP9804T-E/MC; MOUSER_PRICE-STOCK: https://www.mouser.co.uk/ProductDetail/Microchip-Technology-Atmel/MCP9804T-E-MC?qs=AzWaBQTUlgyipBCBrPFKaA%3D%3D
U11 = SamacSys_Parts:CM1624-08DE: ON SEMICONDUCTOR - CM1624-08DE. - EMI Filter, 4-Channel, ESD Protection, 300MHz, Line Protection, UDFN-16 Source: Datasheet <http://www.onsemi.com/pub/Collateral/CM1624-D.PDF>; ARROW_PART_NUMBER: CM1624-08DE; ARROW_PRICE-STOCK: https://www.arrow.com/en/products/cm1624-08de/on-semiconductor?region=nac; DESCRIPTION: ON SEMICONDUCTOR - CM1624-08DE. - EMI Filter, 4-Channel, ESD Protection, 300MHz, Line Protection, UDFN-16; HEIGHT: 0.55mm; MANUFACTURER_NAME: onsemi; MANUFACTURER_PART_NUMBER: CM1624-08DE; MOUSER_PART_NUMBER: 748-CM1624-08DE; MOUSER_PRICE-STOCK: https://www.mouser.co.uk/ProductDetail/onsemi/CM1624-08DE?qs=bXBibfwyPRFMJRiP9A%252BDOw%3D%3D
X1 = SamacSys_Parts:282834-2: TE CONNECTIVITY / BUCHANAN - 282834-2 - TERMINAL BLOCK, WIRE TO BRD, 2POS, 16AWG Source: Datasheet <https://www.te.com/commerce/DocumentDelivery/DDEController?Action=srchrtrv&DocNm=282834&DocType=Customer Drawing&DocLang=English&DocFormat=pdf&PartCntxt=282834-2>; ALLIED_NUMBER: 70086732; ALLIED_PRICE-STOCK: https://www.alliedelec.com/te-connectivity-282834-2/70086732/; DESCRIPTION: TE CONNECTIVITY / BUCHANAN - 282834-2 - TERMINAL BLOCK, WIRE TO BRD, 2POS, 16AWG; HEIGHT: 10.3mm; MANUFACTURER_NAME: TE CONNECTIVITY / BUCHANAN; MANUFACTURER_PART_NUMBER: 282834-2
X2 = GFB_Sensorsystem:SSW-101-02-G: THROUGH-HOLE .025" SQ POST SOCKET Source: Samtec SSW.pdf; MF: Samtec Inc.; MPN: SSW-101-02-G-D; OC_FARNELL: unknown; OC_NEWARK: 82P1456
X3 X4 = GFB_Sensorsystem:SSW-104-02-G-S: THROUGH-HOLE .025" SQ POST SOCKET Source: Samtec SSW.pdf; MF: Samtec Inc.; MPN: SSW-104-02-G-S; OC_FARNELL: unknown; OC_NEWARK: 11P9384
X5 = SamacSys_Parts:CONUFL001-SMD-T: RF Connectors / Coaxial Connectors T&R U.FL Straight Surface Mount Jack Source: Datasheet <https://linxtechnologies.com/wp/product/mhf-rf-connectors/>; DESCRIPTION: RF Connectors / Coaxial Connectors T&R U.FL Straight Surface Mount Jack; HEIGHT: mm; MANUFACTURER_NAME: Linx Technologies; MANUFACTURER_PART_NUMBER: CONUFL001-SMD-T; MOUSER_PART_NUMBER: 712-CONUFL001-SMD-T; MOUSER_PRICE-STOCK: https://www.mouser.co.uk/ProductDetail/Linx-Technologies/CONUFL001-SMD-T?qs=EU6FO9ffTwfRdkBeQTdJWQ%3D%3D
X6 = GFB_Sensorsystem:MEM2051-00-195-00-A: MICRO SD PUSH PUSH, OPEN, SMT, 1 Source: Datasheet <https://gct.co/files/drawings/mem2051.pdf>; DESCRIPTION: MICRO SD PUSH PUSH, OPEN, SMT, 1; HEIGHT: 2.05mm; MANUFACTURER_NAME: GCT (GLOBAL CONNECTOR TECHNOLOGY); MANUFACTURER_PART_NUMBER: MEM2051-00-195-00-A; MOUSER_PART_NUMBER: 640-MEM20510019500A; MOUSER_PRICE-STOCK: https://www.mouser.co.uk/ProductDetail/GCT/MEM2051-00-195-00-A?qs=KUoIvG%2F9Ilat7yfJRNWXUQ%3D%3D
Y1 = GFB_Sensorsystem:830069392: Crystals WE-XTAL 16.3840MHz 20ppm 2.5 x 2.0mm Source: Datasheet <https://www.we-online.com/catalog/datasheet/830069395.pdf>; DESCRIPTION: Crystals WE-XTAL 16.3840MHz 20ppm 2.5 x 2.0mm; HEIGHT: 0.6mm; MANUFACTURER_NAME: Wurth Elektronik; MANUFACTURER_PART_NUMBER: 830069395; MOUSER_PART_NUMBER: 710-830069395; MOUSER_PRICE-STOCK: https://www.mouser.co.uk/ProductDetail/Wurth-Elektronik/830069395?qs=2WXlatMagcEjCaFVx2ZbsQ%3D%3D

## Board
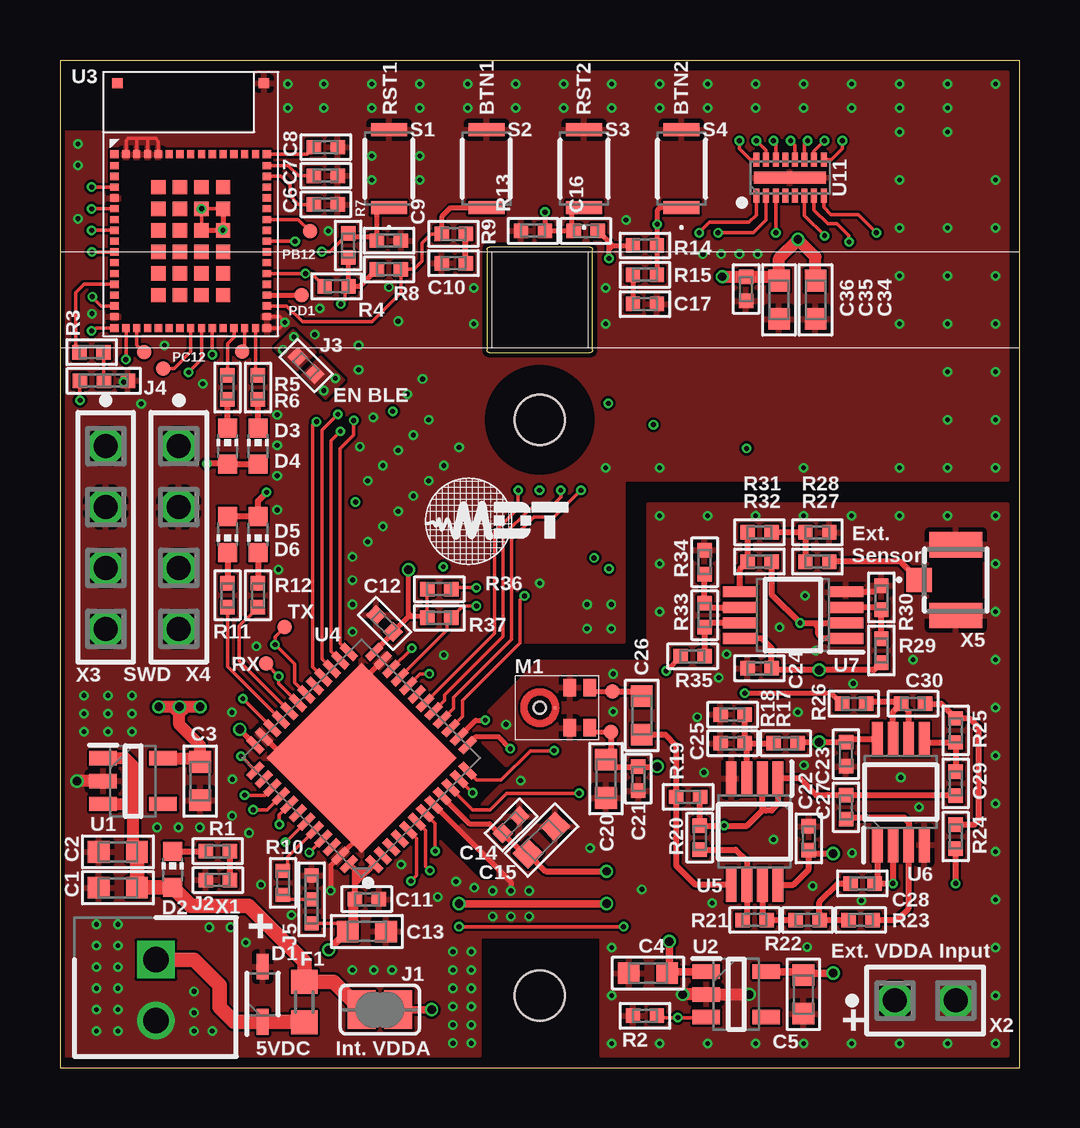
[diagram p6: board, top side]
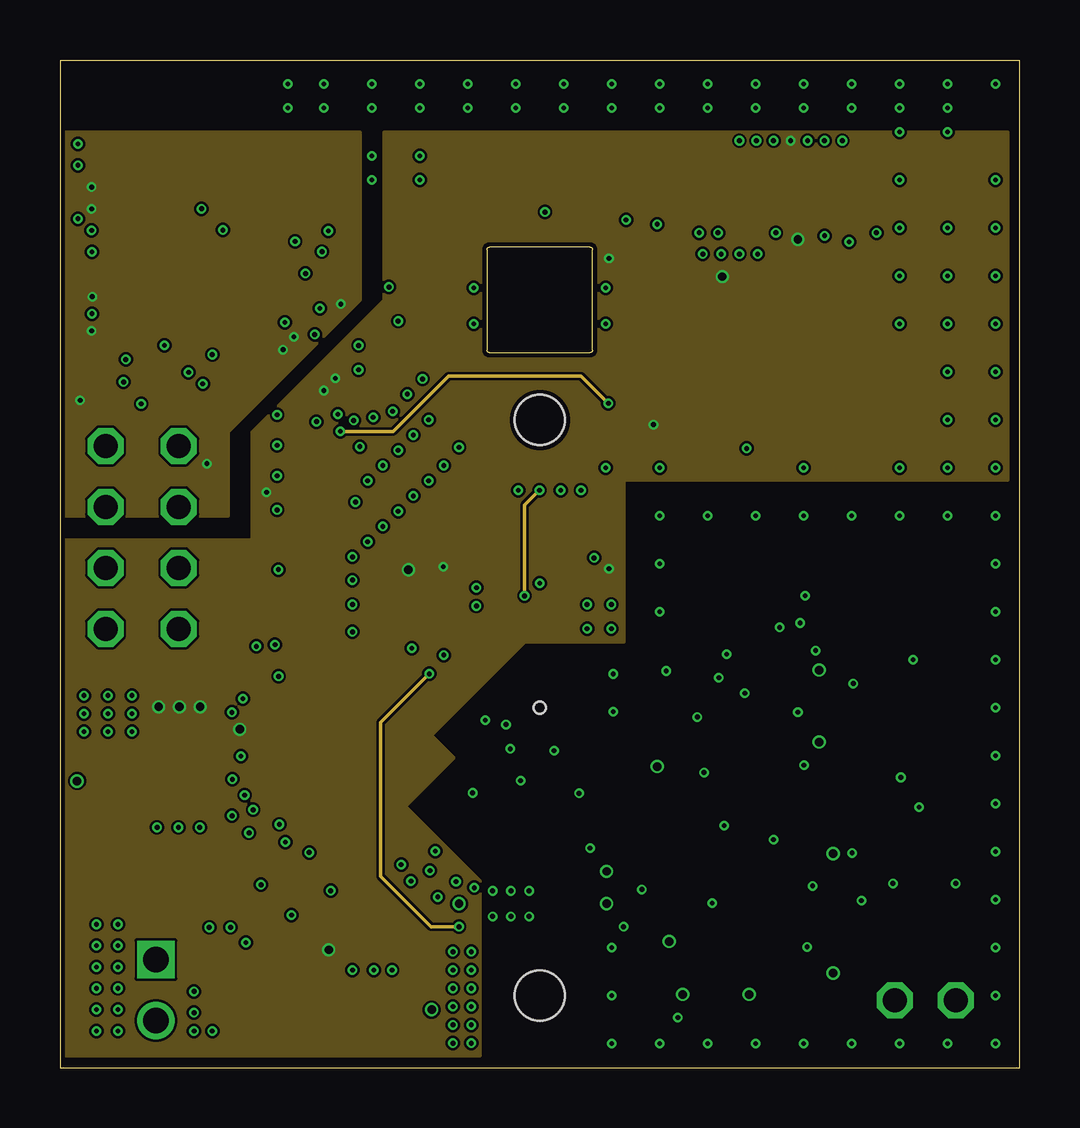
[diagram p7: board, inner layer Route2]
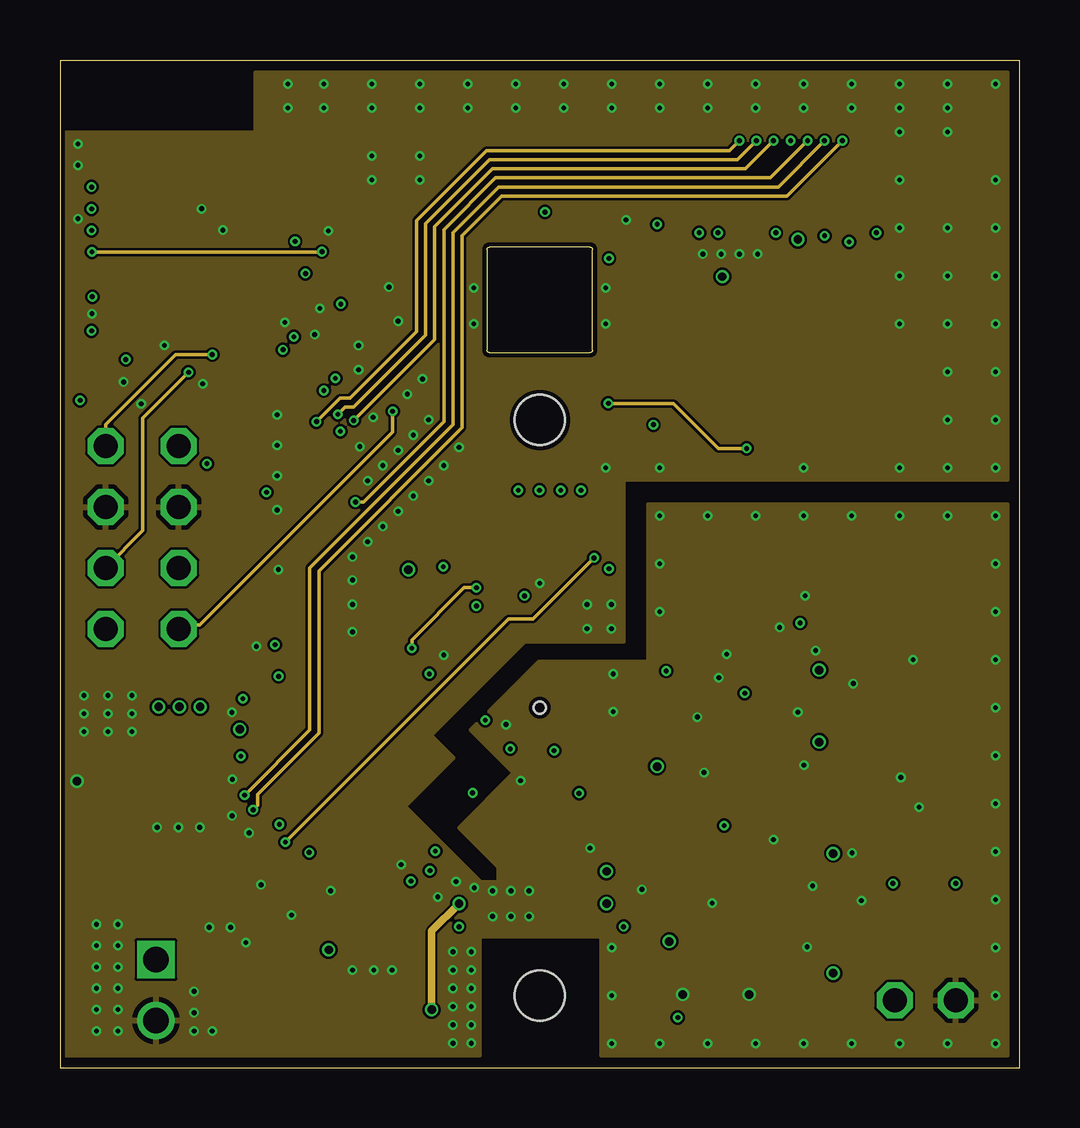
[diagram p8: board, inner layer Route3]
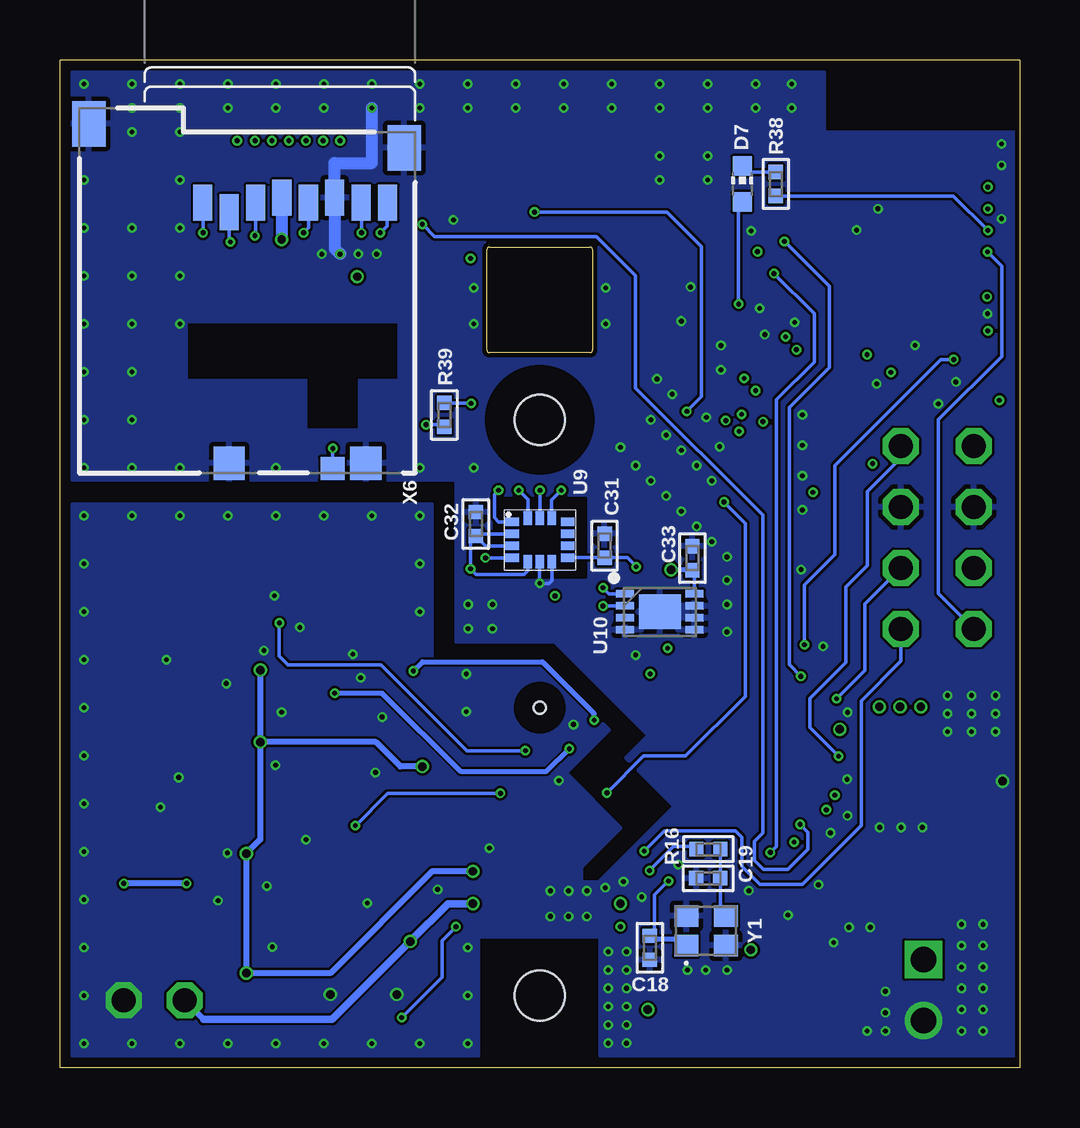
[diagram p9: board, bottom side, seen from below]

Size 40 x 42 mm. Coordinates in mm from the lower left corner, seen from the top.
Outline: 0,0 40,0 40,42 0,42 0,0
Outline: 17.9,29.8 22.1,29.8 arc90 22.2,29.9 22.2,34.1 arc90 22.1,34.2 17.9,34.2 arc90 17.8,34.1 17.8,29.9 arc90 17.9,29.8
Copper layers (1+2*3+16): Top 0.018mm / dielectric 0.36mm / Route2 0.035mm / dielectric 0.71mm / Route3 0.035mm / dielectric 0.36mm / Bottom 0.018mm
Design rules "Multi-CB_4L_100µm-Tracks_OL35µm-IL35µm *": minimum track width 0.1mm, minimum drill 0.2mm, track to track 0.1mm, track to pad 0.1mm, pad to pad 0.1mm, via to via 0.1mm, smd to smd 0mil, copper to edge 0.2mm, drill to drill 0.2mm, minimum pad ring 0.125mm, minimum via ring 0.1mm, stop-mask expansion 2mil, vias tented up to drill 0mil, thermal gap 0.2mm
Holes 2.1 mm at 20,3 20,27
tRestrict: area 17.8,0.8 to 22.2,5.2; area 17.8,24.8 to 22.2,29.2
bRestrict: area 19,14 to 21,16; area 17.8,0.8 to 22.2,5.2; area 17.8,24.8 to 22.2,29.2

### Footprints (pad centres in the part's own frame; a part is rotated, then mirrored left to right if it is on the bottom)
PATCHPOLYGRAPHV1_1608M = smd 0.9 x 0.9: 1 -0.8,0; 2 0.8,0
PATCHPOLYGRAPHV1_1005M = smd 0.6 x 0.6: 1 -0.5,0; 2 0.5,0
SOD2513X114N = smd 1.075 x 0.5: 1 -1.15,0; 2 1.15,0
CHIP-LED0603 = smd 0.8 x 0.8: A 0,-0.75; C 0,0.75
R0603 = smd 1 x 1.1: 1 -0.85,0; 2 0.85,0
SJ = smd 1.168 x 1.6: 1 -0.762,0; 2 0.762,0
JUMPER_3_0402 = smd 0.6 x 0.6: 1 -1,0; 2 0,0; 3 1,0
IMP23ABSU = smd 0.725 x 0.522: 1 -0.838,2.074; 2 -0.838,1.252; 4 0.838,1.252; 5 0.838,2.074 | smd 0.1 x 0.1: 3 0,0.65 | hole 0.5: 0,0
TP06R = smd 0.6 x 0.6: TP 0,0
TS193206BK701SMTTR67 = smd 0.55 x 1.5: 1 -1.625,0; 2 1.625,0
SOT95P280X145-5N = smd 1.15 x 0.6: 1 -1.25,0.95; 2 -1.25,0; 3 -1.25,-0.95; 4 1.25,-0.95; 5 1.25,0.95
STM32WB5MMG = smd 0.35 x 0.35: 1 0.475,7.575; 17 0.475,0.325; 31 6.825,0.325; 47 6.825,7.575 | smd 0.35 x 0.3: 2 0.476,7.1; 3 0.475,6.65; 4 0.475,6.2; 5 0.475,5.75; 6 0.475,5.3; 7 0.475,4.85; 8 0.475,4.4; 9 0.475,3.95; 10 0.475,3.5; 11 0.475,3.05; 12 0.475,2.6; 13 0.475,2.15; 14 0.475,1.7; 15 0.475,1.25; 16 0.475,0.8; 32 6.825,0.8; 33 6.825,1.25; 34 6.825,1.7; 35 6.825,2.15; 36 6.825,2.6; 37 6.825,3.05; 38 6.825,3.5; 39 6.825,3.95; 40 6.825,4.4; 41 6.825,4.85; 42 6.825,5.3; 43 6.825,5.75; 44 6.825,6.2; 45 6.825,6.65; 46 6.825,7.1 | smd 0.3 x 0.35: 18 0.95,0.325; 19 1.4,0.325; 20 1.85,0.325; 21 2.3,0.325; 22 2.75,0.325; 23 3.2,0.325; 24 3.65,0.325; 25 4.1,0.325; 26 4.55,0.325; 27 5,0.325; 28 5.45,0.325; 29 5.9,0.325; 30 6.35,0.325; 48 6.35,7.575; 49 5.9,7.575; 50 5.45,7.575; 51 5,7.575; 52 4.55,7.575; 53 4.1,7.575; 54 3.65,7.575; 55 3.2,7.575; 56 2.75,7.575; 57 2.3,7.575; 58 1.85,7.575; 59 1.4,7.575; 60 0.95,7.575 | smd 0.6 x 0.6: 61 2.3,6.2; 62 2.3,5.3; 63 2.3,4.4; 64 2.3,3.5; 65 2.3,2.6; 66 2.3,1.7; 67 3.2,1.7; 68 4.1,1.7; 69 5,1.7; 70 5,2.6; 71 5,3.5; 72 5,4.4; 73 5,5.3; 74 5,6.2; 75 4.1,6.2; 76 3.2,6.2; 77 3.2,5.3; 78 3.2,4.4; 79 3.2,3.5; 80 3.2,2.6; 81 4.1,2.6; 82 4.1,3.5; 83 4.1,4.4; 84 4.1,5.3 | smd 0.43 x 0.43: 85 0.6,10.535; 86 6.7,10.535
QFN50P700X700X65-49N = smd 0.8 x 0.3: 1 -3.5,2.75; 2 -3.5,2.25; 3 -3.5,1.75; 4 -3.5,1.25; 5 -3.5,0.75; 6 -3.5,0.25; 7 -3.5,-0.25; 8 -3.5,-0.75; 9 -3.5,-1.25; 10 -3.5,-1.75; 11 -3.5,-2.25; 12 -3.5,-2.75; 25 3.5,-2.75; 26 3.5,-2.25; 27 3.5,-1.75; 28 3.5,-1.25; 29 3.5,-0.75; 30 3.5,-0.25; 31 3.5,0.25; 32 3.5,0.75; 33 3.5,1.25; 34 3.5,1.75; 35 3.5,2.25; 36 3.5,2.75 | smd 0.3 x 0.8: 13 -2.75,-3.5; 14 -2.25,-3.5; 15 -1.75,-3.5; 16 -1.25,-3.5; 17 -0.75,-3.5; 18 -0.25,-3.5; 19 0.25,-3.5; 20 0.75,-3.5; 21 1.25,-3.5; 22 1.75,-3.5; 23 2.25,-3.5; 24 2.75,-3.5; 37 2.75,3.5; 38 2.25,3.5; 39 1.75,3.5; 40 1.25,3.5; 41 0.75,3.5; 42 0.25,3.5; 43 -0.25,3.5; 44 -0.75,3.5; 45 -1.25,3.5; 46 -1.75,3.5; 47 -2.25,3.5; 48 -2.75,3.5 | smd 5.6 x 5.6: 49 0,0
SOP65P490X110-8N = smd 1.425 x 0.45: 1 -2.212,0.975; 2 -2.212,0.325; 3 -2.212,-0.325; 4 -2.212,-0.975; 5 2.212,-0.975; 6 2.212,-0.325; 7 2.212,0.325; 8 2.212,0.975
IIS3DWB = smd 0.575 x 0.35: 1 -1.163,0.75; 2 -1.163,0.25; 3 -1.163,-0.25; 4 -1.163,-0.75; 8 1.163,-0.75; 9 1.163,-0.25; 10 1.163,0.25; 11 1.163,0.75 | smd 0.35 x 0.575: 5 -0.5,-0.912; 6 0,-0.912; 7 0.5,-0.912; 12 0.5,0.912; 13 0,0.912; 14 -0.5,0.912
SON50P300X200X100-9N = smd 0.75 x 0.3: 1 -1.45,0.75; 2 -1.45,0.25; 3 -1.45,-0.25; 4 -1.45,-0.75; 5 1.45,-0.75; 6 1.45,-0.25; 7 1.45,0.25; 8 1.45,0.75 | smd 1.75 x 1.45: 9 0,0
SON40P135X330X55-17N = smd 0.6 x 0.25: 1 -0.75,1.4; 2 -0.75,1; 3 -0.75,0.6; 4 -0.75,0.2; 5 -0.75,-0.2; 6 -0.75,-0.6; 7 -0.75,-1; 8 -0.75,-1.4; 9 0.75,-1.4; 10 0.75,-1; 11 0.75,-0.6; 12 0.75,-0.2; 13 0.75,0.2; 14 0.75,0.6; 15 0.75,1; 16 0.75,1.4 | smd 0.5 x 3: 17 0,0
SHDR2W85P0X254_1X2_554X650X103 = drill 1.05 pad 1.575 square: 1 0,0 | drill 1.05 pad 1.575: 2 2.54,0
SSW-101-02-G-D = drill 1 pad 1.5 octagon: 1 0,-1.27; 2 0,1.27
SSW-104-02-G-S = drill 1 pad 1.5 octagon: 1 -3.81,0; 2 -1.27,0; 3 1.27,0; 4 3.81,0
CONUFL001-SMD = smd 1 x 1.05: 1 0,-1.525 | smd 1.05 x 2.2: 2 -1.475,0; 3 1.475,0
MEM20510019500A = smd 1 x 0.95: CD 3.44,-0.175 | smd 1.3 x 1.4: MP1 2.05,-0.4; MP2 7.75,-0.4 | smd 1.4 x 1.9: MP3 0.45,-13.55; MP4 13.6,-14.55 | smd 0.8 x 1.5: P1 8.85,-11.26; P2 7.75,-10.86; P3 6.65,-11.26; P4 5.55,-11.46; P5 4.45,-11.26; P6 3.35,-11.46; P7 2.25,-11.26; P8 1.15,-11.26
830069392 = smd 1 x 0.9: 1 -0.825,-0.613; 2 0.825,-0.613; 3 0.825,0.613; 4 -0.825,0.613

### Placement (x,y rotation side)
C1  2.41,7.49 180 top
C2  2.41,8.99 180 top
C3  5.84,11.94 270 top
C4  24.51,3.94 180 top
C5  30.99,3.05 270 top
C6  11.08,35.98 0 top
C7  11.08,37.17 0 top
C8  11.08,38.37 0 top
C9  13.72,34.47 0 top
C10  16.41,33.53 180 top
C11  12.79,7.02 0 top
C12  13.53,18.51 135 top
C13  12.79,5.67 0 top
C14  18.81,10.12 45 top
C15  20.08,9.48 45 top
C16  19.72,34.88 180 top
C17  24.38,31.83 0 top
C18  15.41,4.99 270 bottom
C19  12.98,7.89 180 bottom
C20  22.76,12.04 270 top
C21  24.1,12.04 270 top
C22  31.22,9.55 90 top
C23  32.77,13.06 270 top
C24  29.16,16.64 180 top
C25  28.04,13.52 180 top
C26  24.26,14.68 270 top
C27  32.77,10.85 270 top
C28  33.45,7.67 180 top
C29  37.34,11.84 90 top
C30  35.56,15.16 0 top
C31  17.3,21.75 90 bottom
C32  22.67,22.66 90 bottom
C33  13.64,21.23 90 bottom
C34  31.5,32 270 top
C35  29.97,32 270 top
C36  28.6,32.45 270 top
D1  8.45,3.06 90 top
D2  4.7,8.26 0 top
D3  6.99,25.91 0 top
D4  8.26,25.91 0 top
D5  6.99,22.23 180 top
D6  8.26,22.23 180 top
D7  11.56,36.83 0 bottom
F1  10.19,2.73 90 top
J1  13.34,2.41 180 top
J2  6.58,7.81 0 top
J3  10.26,29.26 315 top
J4  1.83,28.63 0 top
J5  10.49,7.01 90 top
M1  20,15 270 top
PA12  7.59,29.84 0 top
PB5  3.51,29.82 0 top
PB12  10.42,34.86 0 top
PC12  4.3,29.15 0 top
PD1  10.07,32.19 0 top
R1  6.58,9.02 180 top
R2  24.38,2.16 0 top
R3  1.32,29.82 0 top
R4  11.53,32.56 0 top
R5  6.99,28.35 270 top
R6  8.26,28.35 270 top
R7  12.01,34.26 270 top
R8  13.72,33.27 180 top
R9  16.41,34.75 180 top
R10  9.3,7.7 270 top
R11  6.99,19.68 90 top
R12  8.26,19.68 90 top
R13  21.92,34.87 0 top
R14  24.38,34.26 180 top
R15  24.38,33.05 0 top
R16  12.97,9.1 180 bottom
R17  30.25,13.52 0 top
R18  28.04,14.71 0 top
R19  26.19,11.28 0 top
R20  26.67,9.58 90 top
R21  28.96,6.15 180 top
R22  31.17,6.15 0 top
R23  33.38,6.15 0 top
R24  37.34,9.63 270 top
R25  37.34,14.05 90 top
R26  33.1,15.16 0 top
R27  31.57,21.09 180 top
R28  31.57,22.31 180 top
R29  34.24,17.38 270 top
R30  34.24,19.59 270 top
R31  29.16,22.31 180 top
R32  29.16,21.09 180 top
R33  26.87,18.85 270 top
R34  26.87,21.06 270 top
R35  26.37,17.15 0 top
R36  15.81,19.94 180 top
R37  15.81,18.75 180 top
R38  10.16,36.83 90 bottom
R39  23.98,27.2 270 bottom
RX  8.59,16.84 0 top
S1  13.72,37.47 90 top
S2  17.78,37.47 90 top
S3  21.84,37.47 90 top
S4  25.91,37.47 90 top
TP1  22.96,14 0 top
TP2  23.04,15.67 0 top
TX  9.37,18.36 0 top
U1  3.05,11.94 0 top
U2  28.19,3.05 0 top
U3  1.8,30.5 0 top
U4  12.57,12.9 135 top
U5  28.96,9.83 270 top
U6  35.05,11.48 90 top
U7  30.56,18.85 180 top
U9  20,22 0 bottom
U10  15,19 0 bottom
U11  30.43,37.09 90 top
X1  4,4.5 270 top
X2  36.07,2.79 270 top
X3  1.91,22.1 270 top
X4  4.95,22.1 270 top
X5  37.34,20.32 270 top
X6  25.2,24.79 180 bottom
Y1  13.07,5.7 0 bottom

### Tracks (layer width: path | path; a pad name or v marks a point on that pad's centre or on a via)
+3V3_A  (via drill 0.35)
  Top 0.203: C14.1 18.31,9.77 17.91,10.16 17.08,10.16 U4.9 | C5.1 30.91,3.92 30.91,4 | M1.5 22.24,13.99 TP1.TP
  Top 0.254: U5.8 30.57,7.62 31.22,8.27 C22.1 31.23,9.04 31.23,8.92 v32.23,8.92 | U6.8 32.9,13.7 C23.1 32.76,13.57 v31.65,13.57 30.8,13.57 R17.2 | U7.8 29.26,17.88 29.66,17.48 C24.1 29.73,16.57 v31.65,16.57 33.93,16.57 R29.2 | v24.89,12.55 24.88,12.54 C21.1 23.06,12.54 C20.1 22.96,13.04 TP1.TP | v22.78,8.18 20.25,8.18 C15.1 19.3,8.92 C14.1 | C5.1 30.99,3.92 31,3.94
  Top 0.305: 30.91,4 U2.5 | 31,3.94 v32.23,3.94
  Bottom 0.254: v31.65,16.57 v31.65,13.57 | v31.65,13.57 31.65,9.5 v32.23,8.92 v32.23,3.94 28.73,3.94 24.49,8.18 v22.78,8.18 | v24.89,12.55 25.81,12.55 26.83,13.57 v31.65,13.57
+3V3_D  (via drill 0.2, 0.35)
  Top 0.152: U11.12 30.63,38.45 v30.45,38.63 | J5.1 11.66,6.01 C13.1 | R37.2 R36.2
  Top 0.203: 23.04,34.27 R14.2 | v22.89,33.73 22.89,34.11 | 22.89,34.11 23.04,34.27 | U4.36 v7.49,14.09 v7.49,14.1 | U4.24 13.88,18.11 C12.1 14.52,18.8 | v14.53,20.75 v14.52,20.75 14.52,18.92 | 14.52,18.8 14.52,18.92 | R37.2 15.26,18.8 14.65,18.8 | 14.65,18.8 14.52,18.8 | 14.52,18.92 14.65,18.8 | R13.2 22.89,34.42 | 22.89,34.42 23.04,34.27 | 22.89,34.11 22.89,34.42
  Top 0.254: D5.A D6.A 8.26,23.62 v8.61,23.98 | C11.1 12.29,7.67 | 12.29,7.67 12.58,7.97 | 12.58,7.97 12.77,8.16 | 12.77,8.16 U4.1 | U4.48 12.29,8.23 | 12.29,7.67 12.29,8.03 | 12.29,8.03 12.29,8.23 | 12.77,8.16 12.37,8.16 12.29,8.23 | 12.29,8.03 12.35,7.97 12.58,7.97
  Top 0.305: v11.2,4.91 11.97,5.67 C13.1
  Top 0.406: C13.1 12.22,5.9 12.22,6.95 C11.1
  Top 0.508: U1.5 5.77,12.89 C3.1 5.84,13.44 4.98,14.3 4.98,14.76 | v5.84,15.04 5.26,15.04 | 5.26,15.04 v4.98,15.04 | v4.98,15.04 4.7,15.04 | 4.7,15.04 v4.12,15.04 | 4.98,14.76 v4.98,15.04 | 5.26,15.04 4.98,14.76 | 4.98,14.76 4.7,15.04 | v27.61,32.97 27.63,32.95 C36.1 29.82,32.95 C35.1 29.97,33.73 v30.76,34.52 31.5,33.78 C34.1
  Bottom 0.152: v24.74,26.8 24.07,26.8 R39.2 | U9.2 22.57,22.25 C32.1 | U9.3 22.26,21.75 C32.1 | U9.5 20.5,20.71 20.65,20.56 22.66,20.56 v22.89,20.79 22.89,21.93 C32.1 | U9.8 C31.1 16.35,21.25 v15.98,20.88 | U9.8 | U10.8 13.55,20.65 C33.1
  Bottom 0.203: v14.53,20.75 13.65,20.75 C33.1
  Bottom 0.508: X6.P4 30.76,36.24 v30.76,34.52
  other vias: 11,28.22 11.48,28.73
  pour Route2 (rank 2): -1.5,0.5 17.5,0.5 17.5,7.79 14.41,10.88 16.42,12.9 15.48,13.84 19.38,17.74 23.5,17.74 23.5,24.5 39.5,24.5 39.5,39 13.5,39 13.5,32 8,26.5 8,22 -1.5,22
  pour Top (no thermals): 10.07,28.87 10.86,29.65 11.86,28.65 11.07,27.86
+5V_A  (via drill 0.35)
  Top 0.305: v16.64,6.83 v22.78,6.83 | v25.4,5.26 25.4,3.95 C4.1 25.45,4 U2.1 | J1.1 v15.49,2.41
  Route3 0.305: v15.49,2.41 15.49,5.69 v16.64,6.83
  Bottom 0.254: 34.01,2.01 X2.1
  Bottom 0.305: v22.78,6.83 23.82,6.83 v25.4,5.26 28.65,2.01 34.01,2.01
+5V_D
  Top 0.508: 3.05,10.67 3.05,11.31 | 3.05,11.31 3.05,12.57 2.73,12.89 U1.1 | U1.3 2.73,10.99 | 2.73,10.99 3.05,10.67 | 2.73,10.99 3.05,11.31 | C2.1 3.05,9.16 3.05,10.67
  Top 0.61: J1.2 11.4,3.58 F1.2 10.19,4.42 7.86,6.74 5.46,6.74 D2.A 3.23,7.5 C1.1 C2.1
+VBLE  (via drill 0.2)
  Top 0.152: U3.17 1.51,30.82 1.4,30.71 v1.32,30.71 | U3.15 1.72,31.75 v1.35,32.12 v1.35,32.13 | U3.6 1.33,35.8 v1.32,35.79 | U3.4 v1.32,36.7 | R4.2 11.88,32.41 11.88,32 v11.71,31.83 | J4.1 0.83,27.82 v0.84,27.81
  Top 0.203: R8.2 12.51,32.56 R4.2 12.01,32.58 R7.2
  Top 0.254: D4.A D3.A 6.97,25.17 v6.12,25.17
  Bottom 0.152: D7.A 11.71,35.93 v11.71,31.83
  other vias: 9.75,30.45 9.3,29.92
  pour Route2: -1.5,23 7,23 7,26.5 12.5,32 12.5,39 -1.5,39
  pour Top (no thermals): 9.89,29.04 10.67,29.82 9.73,30.76 8.95,29.98
ACC_INT1  (via drill 0.2)
  Top 0.152: U4.43 9.42,9.4 v9.4,9.4
  Route3 0.152: v9.4,9.4 18.7,18.7 19.73,18.7 v22.27,21.25
  Bottom 0.152: v22.27,21.25 v22.26,21.25 U9.4
BOOT0
  Top 0.152: U4.44 9.5,8.77 9.5,8.4 R10.1
BTN  (via drill 0.2)
  Top 0.152: v9.14,10.13 9.14,10.54 9.6,10.99 U4.41
  Top 0.203: R15.2 R14.1 v24.88,35.15 v24.89,35.15 24.89,35.71 25.02,35.84 S4.1
  Bottom 0.152: v9.14,10.13 8.81,9.8 8.81,9.09 9.65,8.26 10.67,8.26 11.05,8.64 11.05,9.44 10.71,9.78 10.71,23.03 16,28.32 16,33.02 17.63,34.65 24.38,34.65 v24.89,35.15
DEV_RDY  (via drill 0.2)
  Top 0.152: U4.45 v10.4,8.97 v10.39,8.97 | U3.36 v10.23,33.1 v10.24,33.1 10.49,33.1 R4.1
  Bottom 0.152: v10.39,8.97 10.13,9.22 10.13,27.84 8.56,29.41 8.56,31.27 8.56,31.42 v10.24,33.1
EXT_SEN  (via drill 0.2)
  Top 0.203: U4.14 17.33,14.48 v17.73,14.48 | R35.1 25.87,17.13 v25.27,16.53
  Bottom 0.203: v17.73,14.48 17.73,14.76 19.89,16.91 24.89,16.91 v25.27,16.53
GND  (via drill 0.2, 0.35)
  Top 0.152: U3.60 2.75,38.64 2.85,38.73 3.2,38.73 | 3.2,38.73 3.66,38.73 | 3.66,38.73 3.99,38.73 4.1,38.62 U3.57 | U3.59 3.2,38.73 | 3.2,38.73 | U3.58 3.65,38.73 3.66,38.73 | U3.32 9.16,31.3 9.37,31.09 v9.37,31.06 9.37,31.04 9.16,30.82 U3.31 | U3.83 U3.84 | U3.73 U3.84
  Top 0.203: U4.49 12.57,9.72 U4.47 11.29,8.44 v11.29,7.37 | U4.35 9.39,12.9 U4.49 | U4.23 12.57,16.09 U4.49 | U4.8 18.8,7.74 v18.8,7.37 | U3.83 U3.72 U3.73
  Top 0.254: R30.1 33.98,19.83 U7.4
  Top 0.508: U1.2 v0.71,11.94 | v25.96,3.05 U2.2 v28.73,3.05
  Bottom 0.152: U9.7 19.5,20.31 19.62,20.19 v20,20.19 U9.6
  Bottom 0.508: v28.32,33.91 28.55,34.13 X6.P6 28.55,37.69 28.55,37.7 27,37.7 v27,40
  other vias: 29.74,9.5 33.02,8.95 35.81,10.85 31.01,12.6 35.05,12.09 26.85,12.3 24.26,7.42 39,1 30.76,14.81 22.99,18.29 21.97,19.3 30,18.35 31.06,19.67 23.06,14.83 19.2,11.96 18.59,14.3 27.19,6.86 22.1,9.14 33.41,6.96 17.14,1.02 17.14,1.78 17.14,4.83 5.83,10.01 1.52,1.52 2.41,3.3 1.52,3.3 1.52,2.41 2.41,1.52 2.41,2.41 2.41,4.19 1.52,4.19 2.41,5.08 1.52,5.08 16.38,4.83 16.38,4.06 17.14,4.06 17.14,3.3 16.38,3.3 16.38,2.54 17.14,2.54 16.38,1.78 16.38,1.02 18.03,6.3 18.03,7.37 18.8,6.3 19.56,7.37 19.56,6.3 17.27,7.49 15.75,7.11 16.51,7.75 13.84,4.06 13.08,4.06 12.19,4.06 8.38,7.62 9.65,6.35 7.75,5.21 7.11,5.84 6.22,5.84 5.59,1.52 5.59,2.29 5.59,3.17 6.35,1.52 1.52,5.97 2.41,5.97 31.15,5.03 31.38,7.57 27.47,16.25 33.07,16.01 27.79,17.23 39,3 39,5 39,7 39,9 39,11 39,13 39,15 39,17 39,19 39,21 39,23 37,1 35,1 33,1 31,1 29,1 27,1 25,1 23,1 23,3 23,5 33,23 31,23 29,23 27,23 25,23 25,21 25,19 35.56,17 26.57,14.61 23.06,16.41 31.5,17.38 35,23 37,23 39,41 37,41 35,41 33,41 31,41 29,41 27,41 25,41 23,41 21,41 19,41 17,41 15,41 13,41 11,41 9.5,41 13,40 15,40 17,40 19,40 21,40 23,40 25,40 29,40 31,40 33,40 35,40 37,40 11,40 9.5,40 15,38 15,37 13,37 13,38 0.75,38.5 5.9,35.8 0.75,35.38 1,14.75 1,14 2,14.75 2,14 3,14 3,14.75 39,25 39,27 39,29 39,31 39,33 39,35 39,37 37,25 35,25 31,25 25,25 22.75,25 7.17,10.49 7.88,9.78 7.19,12.01 12.19,19.3 12.19,18.16 14.22,8.46 7.16,14.81 12.19,20.32 8.19,17.55 2.65,28.58 3.39,27.66 5.95,28.5 4.35,30.1 9.05,25.94 11.19,34.87 10.83,31.65 16,17.2 14.1,25.73 14.48,28.07 13.06,27.1 10.62,30.56 12.5,25.88 14.73,26.37 15.37,27 13.46,25.1 12.83,24.46 14.1,23.19 14.73,23.83 15.37,24.46 16,25.1 16.64,25.86 13.46,22.56 12.45,30.1 12.45,29.08 14.1,31.11 23.6,35.33 26.8,33.91 12.83,21.92 12.19,21.29 9.05,24.67 9.05,23.24 9.05,27.21 15.11,28.7 0.75,37.61 4.94,10.01 4.05,10.01 17.25,31 17.25,32.5 22.75,31 22.75,32.5 27.56,33.91 29.08,33.91 13.72,32.54 37,39 37,35 35,31 35,33 35,35 35,37 35,39 9.1,20.75 37,29 37,27 37,31 37,33 21.97,18.29 22.99,19.3 1,15.51 2,15.51 3,15.51 1.33,31.42 6.79,34.91
  pour Top (rank 2): -0.5,0.5 17.5,0.5 17.5,5.45 22.54,5.45 22.54,0.5 39.5,0.5 39.5,23.5 24.5,23.5 24.5,16.93 19.95,16.93 17.09,14.07 18.89,12.27 16.61,10 18.25,8.35 18.25,7.74 17.55,7.74 14.41,10.88 16.42,12.9 15.48,13.84 19.38,17.74 23.5,17.74 23.5,24.5 39.5,24.5 39.5,41.5 8.13,41.5 8.13,39 -0.5,39
  cutout Bottom: 18.06,20.43 18.06,23.73 21.92,23.73 21.92,20.43
  pour Route3 (rank 2): -2,0.5 17.5,0.5 17.5,5.45 22.54,5.45 22.54,0.5 39.5,0.5 39.5,23.5 24.5,23.5 24.5,16.93 19.95,16.93 17.09,14.07 18.89,12.27 16.61,10 18.25,8.35 18.25,7.74 17.55,7.74 14.41,10.88 16.42,12.9 15.48,13.84 19.38,17.74 23.5,17.74 23.5,24.5 39.5,24.5 39.5,41.5 8.13,41.5 8.13,39 -2,39
  pour Bottom (rank 2): -1,0.5 17.5,0.5 17.5,5.45 22.54,5.45 22.54,0.5 39.5,0.5 39.5,23.5 24.5,23.5 24.5,16.93 19.95,16.93 17.09,14.07 18.89,12.27 16.61,10 18.25,8.35 18.25,7.74 17.55,7.74 14.41,10.88 16.42,12.9 15.48,13.84 19.38,17.74 23.5,17.74 23.5,24.5 39.5,24.5 39.5,41.5 8.13,41.5 8.13,39 -1,39
  pour Top (no thermals): 2.92,3.05 5.08,3.05 5.08,0.89 2.92,0.89
  pour Bottom (no thermals): 2.92,3.05 5.08,3.05 5.08,0.89 2.92,0.89
  pour Bottom (no thermals): 36.2,3.81 38.35,3.81 38.35,1.65 36.2,1.65
  pour Top (no thermals): 36.2,3.81 38.35,3.81 38.35,1.65 36.2,1.65
  cutout Top: 2.59,31.14 8.33,31.14 8.33,37.77 2.59,37.77
I2C_SCL  (via drill 0.2)
  Top 0.152: U4.21 16.13,18.23 16.13,18.57 R37.1 16.81,19.24 v17.36,19.24
  Bottom 0.152: v17.36,19.24 v17.35,19.25 U10.2
I2C_SDA  (via drill 0.2)
  Top 0.152: U4.22 v14.67,17.48 | R36.1 16.38,20 v17.36,20
  Route3 0.152: v14.67,17.48 14.67,17.83 16.84,20 v17.36,20
  Bottom 0.152: v17.36,20 17.11,19.75 U10.1
LED1
  Top 0.152: R11.1 6.99,16.72 U4.33
LED2
  Top 0.152: R12.1 7.47,18.4 7.47,16.95 U4.32
MCU1_NRST  (via drill 0.2)
  Top 0.152: U3.10 v1.33,34 | v10.92,34.01 11.26,34.01 R7.1
  Top 0.203: R7.1 12.16,34.62 13.06,34.62 C9.1 13.22,35.72 13.34,35.84 S1.1
  Route3 0.152: v1.33,34 10.91,34 v10.92,34.01
  Bottom 0.152: X3.4 3.38,19.76 3.38,27 0.74,29.64 0.74,33.4 v1.33,34
MCU1_SWCLK  (via drill 0.2)
  Top 0.152: U3.26 v6.35,29.72
  Route3 0.152: v6.35,29.72 4.83,29.72 1.91,26.8 X3.1
MCU1_SWDIO  (via drill 0.2)
  Top 0.152: U3.25 5.9,29.52 v5.36,28.98
  Route3 0.152: v5.36,28.98 3.45,27.08 3.45,22.38 X3.3
MCU2_NRST  (via drill 0.2)
  Top 0.152: v15.65,9.02 v15.64,9.02 15.64,10.18 U4.7
  Top 0.203: S3.1 21.39,35.84 21.32,35.77 21.32,34.98 R13.1 C16.1 v20.22,35.66
  Route3 0.152: v13.87,27.36 13.87,26.49 5.82,18.44 5.11,18.44 X4.4
  Bottom 0.152: X4.4 4.95,16.94 6.6,15.29 6.6,10.08 9.04,7.64 10.82,7.64 11.57,8.39 11.57,9.59 11.84,9.86 14.8,9.86 v15.65,9.02 | v20.22,35.66 14.71,35.66 13.26,34.21 13.26,27.96 v13.87,27.36
MCU2_SWCLK  (via drill 0.2)
  Top 0.152: U4.37 v7.54,12.98
  Bottom 0.152: v7.54,12.98 8.74,14.17 8.74,15.39 7.24,16.89 7.24,20.04 6.35,20.93 6.35,24 4.95,25.4 X4.1
MCU2_SWDIO  (via drill 0.2)
  Top 0.152: U4.34 v7.62,15.38
  Bottom 0.152: v7.62,15.38 6.45,16.55 6.45,19.33 X4.3
MIC_OUT  (via drill 0.2)
  Top 0.203: U4.13 17.35,13.79 18.26,13.79 v18.77,13.28 | R26.1 32.16,15.6 v28.55,15.6
  Bottom 0.203: v18.77,13.28 19.71,12.34 23.31,12.34 26.57,15.6 v28.55,15.6
MIC_Q0
  Top 0.254: U5.5 26.49,7.62 25.69,8.43 R19.1 25.69,13.43 25.24,13.88 C26.2
MIC_Q1
  Top 0.254: U5.7 29.28,6.33 R21.1 R22.1
MIC_Q2  (via drill 0.2)
  Top 0.254: v37.34,7.67 R24.2 | U6.1 34.08,7.8 C28.1 v34.72,7.67 v34.73,7.68 U6.2
  Bottom 0.254: v34.72,7.67 v37.34,7.67
N$1
  Top 0.254: R1.1 J2.2
N$2
  Top 0.203: R15.1 C17.1
N$3
  Top 0.203: M1.1 22.24,15.67 TP2.TP
  Top 0.254: TP2.TP 24.07,15.67 C26.1
N$4
  Top 0.254: U5.3 28.63,13.43 C25.1 | C25.1 R17.1 | R18.2 C25.1
N$5
  Top 0.254: R21.2 28.63,6.33 U5.6 28.63,8.61 28.16,9.08 R20.1
N$6
  Top 0.152: U3.13 1,32.65 0.66,32.31 0.66,29.98 R3.1
N$7
  Top 0.254: R23.1 R22.2 31.67,6.9 32.44,7.67 C28.2
N$8
  Top 0.254: U6.5 36.03,13.55 R25.1 C29.2
N$9
  Top 0.254: R23.2 34.89,6.15 35.38,6.64 U6.3 35.38,10.22 35.18,10.42 32.98,10.42 C27.2
N$10
  Top 0.152: C6.1 9.94,35.98 9.58,36.33 9.58,36.78 9.22,37.15 U3.45
N$11
  Top 0.254: D3.C R5.2
N$12
  Top 0.254: X5.1 35.04,21.09 R27.1
N$13
  Top 0.254: R24.1 38.12,10.13 38.3,10.32 38.3,14.18 37.93,14.55 R25.2 36.73,15.16 C30.2
N$14
  Top 0.254: R31.1 R28.2 R27.2
N$15
  Top 0.254: U7.3 34.15,19.18 R30.2 R29.1
N$16
  Top 0.254: U7.6 27.05,19.18 R33.1 R34.2
N$17
  Top 0.254: D4.C R6.2
N$18
  Top 0.254: U7.5 28.34,20.77 R32.2 R31.2
N$19
  Top 0.254: C10.1 R9.1
N$20
  Top 0.152: U3.41 9.93,35.35 PB12.TP
N$21
  Top 0.203: U3.34 PD1.TP
N$22
  Top 0.152: PC12.TP 4.76,29.14 5.45,29.83 U3.24
N$23
  Bottom 0.152: R16.1 C19.1 12.48,6.55 Y1.3
N$24
  Top 0.254: D2.C R1.2
N$25  (via drill 0.2)
  Top 0.152: U11.1 29.03,35.54 28.73,35.23 27.08,35.23 v26.64,34.8
  Bottom 0.152: v26.64,34.8 26.36,35.08 26.36,36.03 X6.P8
N$26
  Top 0.61: X1.1 5.58,4.5 6.66,3.43 6.66,2.52 7.26,1.91 D1.1 10.17,1.91 F1.1
N$27  (via drill 0.2)
  Top 0.152: U3.8 | U3.8 v1.32,34.9
  Bottom 0.152: R38.1 2.75,36.33 v1.32,34.9
N$28
  Top 0.254: D5.C R11.2
N$29
  Top 0.254: D6.C R12.2
N$30
  Bottom 0.152: D7.C 11.31,37.33 R38.2
N$31  (via drill 0.2)
  Top 0.152: U11.3 v29.83,34.81 v29.84,34.8
  Bottom 0.152: X6.P5 29.64,35 v29.84,34.8
N$32  (via drill 0.2)
  Top 0.152: U11.7 31.43,35.75 32,35.18 32.38,35.18 32.89,34.67 v32.89,34.42
  Bottom 0.152: v32.89,34.42 32.94,34.47 X6.P2
N$33  (via drill 0.2)
  Top 0.152: U11.8 31.83,35.86 32.13,35.56 33.27,35.56 v34.04,34.8
  Bottom 0.152: v34.04,34.8 34.04,36.04 X6.P1
N$34  (via drill 0.2)
  Top 0.152: U11.2 29.43,35.33 28.91,34.8 v27.43,34.8
  Bottom 0.152: v27.43,34.8 27.43,36.04 X6.P7
N$35  (via drill 0.2)
  Top 0.152: U11.6 31.03,35.52 v31.88,34.67
  Bottom 0.152: X6.P3 31.85,34.7 v31.88,34.67
N$36
  Top 0.254: R26.2 33.67,15.24 34.98,15.24 C30.1 | U6.6 35.38,14.85 C30.1 | U6.7 34.73,14.83 C30.1
N$37
  Top 0.254: R35.2 R33.2 27.05,18.53 U7.7
N$38
  Top 0.152: R3.2 J4.2
N$39
  Top 0.152: R10.2 9.48,7.01 J5.2
OSC_IN  (via drill 0.2)
  Top 0.152: v14.63,7.77 14.86,8 14.86,9.55 U4.5
  Bottom 0.152: v14.63,7.77 15.21,7.19 15.21,5.69 C18.1
  Bottom 0.203: C18.1 15.29,5.37 14.17,5.37 Y1.1
OSC_OUT  (via drill 0.2)
  Top 0.152: v15.42,8.21 15.24,8.39 15.24,9.88 U4.6
  Bottom 0.152: v15.42,8.21 14.42,9.21 13.58,9.21 R16.2
PA10
  Top 0.152: U3.28 7.25,30.44 6.99,30.18 R5.1
PA11
  Top 0.152: U3.30 8.15,28.95 R6.1
PB10
  Top 0.152: C8.1 10.29,38.08 U3.47
PB11
  Top 0.152: U3.46 9.51,37.6 9.94,37.17 C7.1
PD0
  Top 0.152: U3.33 9.45,31.75 10.11,31.09 13.01,31.09 14.22,32.3 R8.1 14.76,33.27 15.09,33.6 15.09,34.37 15.47,34.75 R9.2
  Top 0.203: S2.1 16.28,35.84 15.91,35.47 R9.2
SD_CD  (via drill 0.2)
  Top 0.152: U4.26 11.3,17.35 11.3,26.14 v11.68,26.52
  Route2 0.152: v22.86,27.69 21.72,28.83 16.2,28.83 13.89,26.52 v11.68,26.52
  Route3 0.152: v28.63,25.81 27.46,25.81 25.58,27.69 v22.86,27.69
  Bottom 0.152: R39.1 22.86,27.7 v22.86,27.69 | v28.63,25.81 28.63,25.8 X6.CD
SD_CK  (via drill 0.2)
  Top 0.152: U4.25 11.68,17.68 11.68,25.81 12.24,26.36 v12.24,26.98 | U11.14 29.83,38.54 v29.74,38.63
  Route3 0.152: v12.24,26.98 15.62,30.35 15.62,35.05 18.03,37.47 28.57,37.47 v29.74,38.63
SD_CMD  (via drill 0.2)
  Top 0.152: U4.11 v17.2,11.45 | U11.11 31.03,38.5 v31.17,38.63
  Route3 0.152: v12.32,23.57 12.65,23.57 16,26.92 16,34.92 18.16,37.08 29.62,37.08 v31.17,38.63
  Bottom 0.152: v17.2,11.45 15.67,12.98 13.92,12.98 11.43,15.47 11.43,22.68 v12.32,23.57
SD_D0  (via drill 0.2)
  Top 0.152: v11.58,27.23 10.92,26.57 10.92,17.03 U4.27 | U11.15 29.43,38.23 v29.03,38.63
  Route3 0.152: v11.58,27.23 11.89,27.53 12.24,27.53 15.24,30.53 15.24,35.18 17.91,37.85 28.25,37.85 v29.03,38.63
SD_D1  (via drill 0.2)
  Top 0.152: U4.28 10.54,16.7 10.54,26.77 v10.69,26.92 | v28.32,38.63 28.32,38.3 28.78,37.84 U11.16
  Route3 0.152: v10.69,26.92 11.68,27.91 12.09,27.91 14.86,30.68 14.86,35.31 17.78,38.23 27.91,38.23 v28.32,38.63
SD_D2  (via drill 0.2)
  Top 0.152: U4.39 8.55,11.35 v7.7,11.35 | U11.10 31.43,38.2 v31.87,38.63
  Route3 0.152: v7.7,11.35 10.41,14.07 10.41,20.83 16.38,26.8 16.38,34.8 18.29,36.7 29.94,36.7 v31.87,38.63
SD_D3  (via drill 0.2)
  Top 0.152: U4.40 8.64,10.74 v8.05,10.74 | U11.9 32.15,37.84 32.61,38.3 v32.61,38.63
  Route3 0.152: v8.05,10.74 8.23,10.92 8.23,11.38 10.79,13.95 10.79,20.7 16.76,26.67 16.76,34.67 18.41,36.32 30.3,36.32 v32.61,38.63
SENSOR_EN  (via drill 0.2)
  Top 0.152: v15.39,16.41 15.02,16.41 U4.20 | R2.2 24.96,2.08 v25.76,2.08 26.93,2.08 U2.3 | v16.64,5.87 v23.5,5.87
  Route2 0.152: v15.39,16.41 13.36,14.38 13.36,7.98 15.47,5.87 v16.64,5.87
  Bottom 0.152: v23.5,5.87 24.08,5.28 24.08,3.76 v25.76,2.08
SPI_CS  (via drill 0.2)
  Top 0.152: U4.18 18.12,18.1 18.12,22.32 19.1,23.3 v19.1,24.07
  Bottom 0.152: U9.12 19.51,23.66 v19.1,24.07
SPI_MISO  (via drill 0.2)
  Top 0.152: U4.16 16.4,14.97 16.4,15.42 18.83,17.85 18.83,22.02 19.75,22.95 20.6,22.95 v21.72,24.07
  Bottom 0.152: v21.72,24.07 21.89,23.89 21.89,22.92 21.72,22.75 U9.1
SPI_MOSI  (via drill 0.2)
  Top 0.152: U4.17 16.02,15.29 16.02,15.52 18.47,17.97 18.47,22.17 19.61,23.3 20.4,23.3 20.88,23.79 v20.88,24.07
  Bottom 0.152: v20.88,24.07 20.5,23.69 U9.14
SPI_SCK  (via drill 0.2)
  Top 0.152: U4.15 16.78,14.64 16.78,15.3 19.19,17.7 19.19,19.48 v19.36,19.66
  Route2 0.152: v19.36,19.66 19.36,23.44 v19.99,24.07
  Bottom 0.152: v19.99,24.07 v20,24.05 U9.13
UART_RES_RX
  Top 0.152: U3.29 7.7,29.95 PA12.TP
UART_RES_TX
  Top 0.152: U3.19 3.2,30.12 PB5.TP
UART_RX  (via drill 0.2)
  Top 0.152: U4.31 9.11,16.01 v9.11,16.31 RX.TP | U3.39 v9.79,34.45 v9.8,34.44
  Bottom 0.152: v9.11,16.31 9.6,16.79 9.6,27.51 7.92,29.19 7.92,32.56 v9.8,34.44
UART_TX  (via drill 0.2)
  Top 0.152: U4.30 9.78,16.05 9.78,16.82 v8.97,17.63 8.97,17.96 TX.TP | U3.18 2.75,29.52 v2.74,29.52
  Bottom 0.152: v2.74,29.52 3.28,29.52 7.7,25.09 7.7,21.39 8.97,20.12 v8.97,17.63
VREF1  (via drill 0.2)
  Top 0.152: U4.10 17.2,10.74 17.93,10.74 18.62,11.43 v21.64,11.43
  Top 0.254: R19.2 26.67,11.26 R20.2 v27.69,10.08 28.64,10.08 29.28,10.72 | 29.28,10.72 29.28,10.85 | 29.28,10.85 U5.2 | C29.1 C27.1 31.53,11.35 30.83,12.05 U5.1 29.93,10.98 29.67,10.72 29.44,10.72 29.41,10.72 | 29.41,10.72 29.28,10.72 | 29.28,10.85 29.41,10.72
  Bottom 0.152: v27.69,10.08 26.34,11.43 v21.64,11.43
VREF2  (via drill 0.2)
  Top 0.152: U4.12 17.37,11.99 18.39,11.99 19.61,13.21 v20.6,13.21
  Top 0.254: R32.1 29.66,19.73 v30.86,18.53 31.42,18.53 31.45,18.53 | 31.45,18.53 31.62,18.53 | 31.62,18.53 31.8,18.53 | 31.8,18.53 U7.2 | U7.1 31.8,17.88 31.62,18.06 31.62,18.35 | 31.62,18.35 31.62,18.53 | 31.8,18.53 31.62,18.35 | 31.45,18.53 31.62,18.35
  Bottom 0.152: v30.86,18.53 30.86,17.16 30.48,16.79 26.62,16.79 23.04,13.21 v20.6,13.21

### Text on the board
tPlace: RST1 | BTN2 | Ext. / Sensor | Ext. VDDA Input | Int. VDDA | +
tNames: U3 | BTN1 | RST2 | EN BLE | SWD | M1 | + | 5VDC
bNames: U9
tStop: GFB Sensor System / Sensorboard V1.0 / TU Berlin - 31.10.2022